# EAGLE design FlightControl (EAGLE 6.5.0)
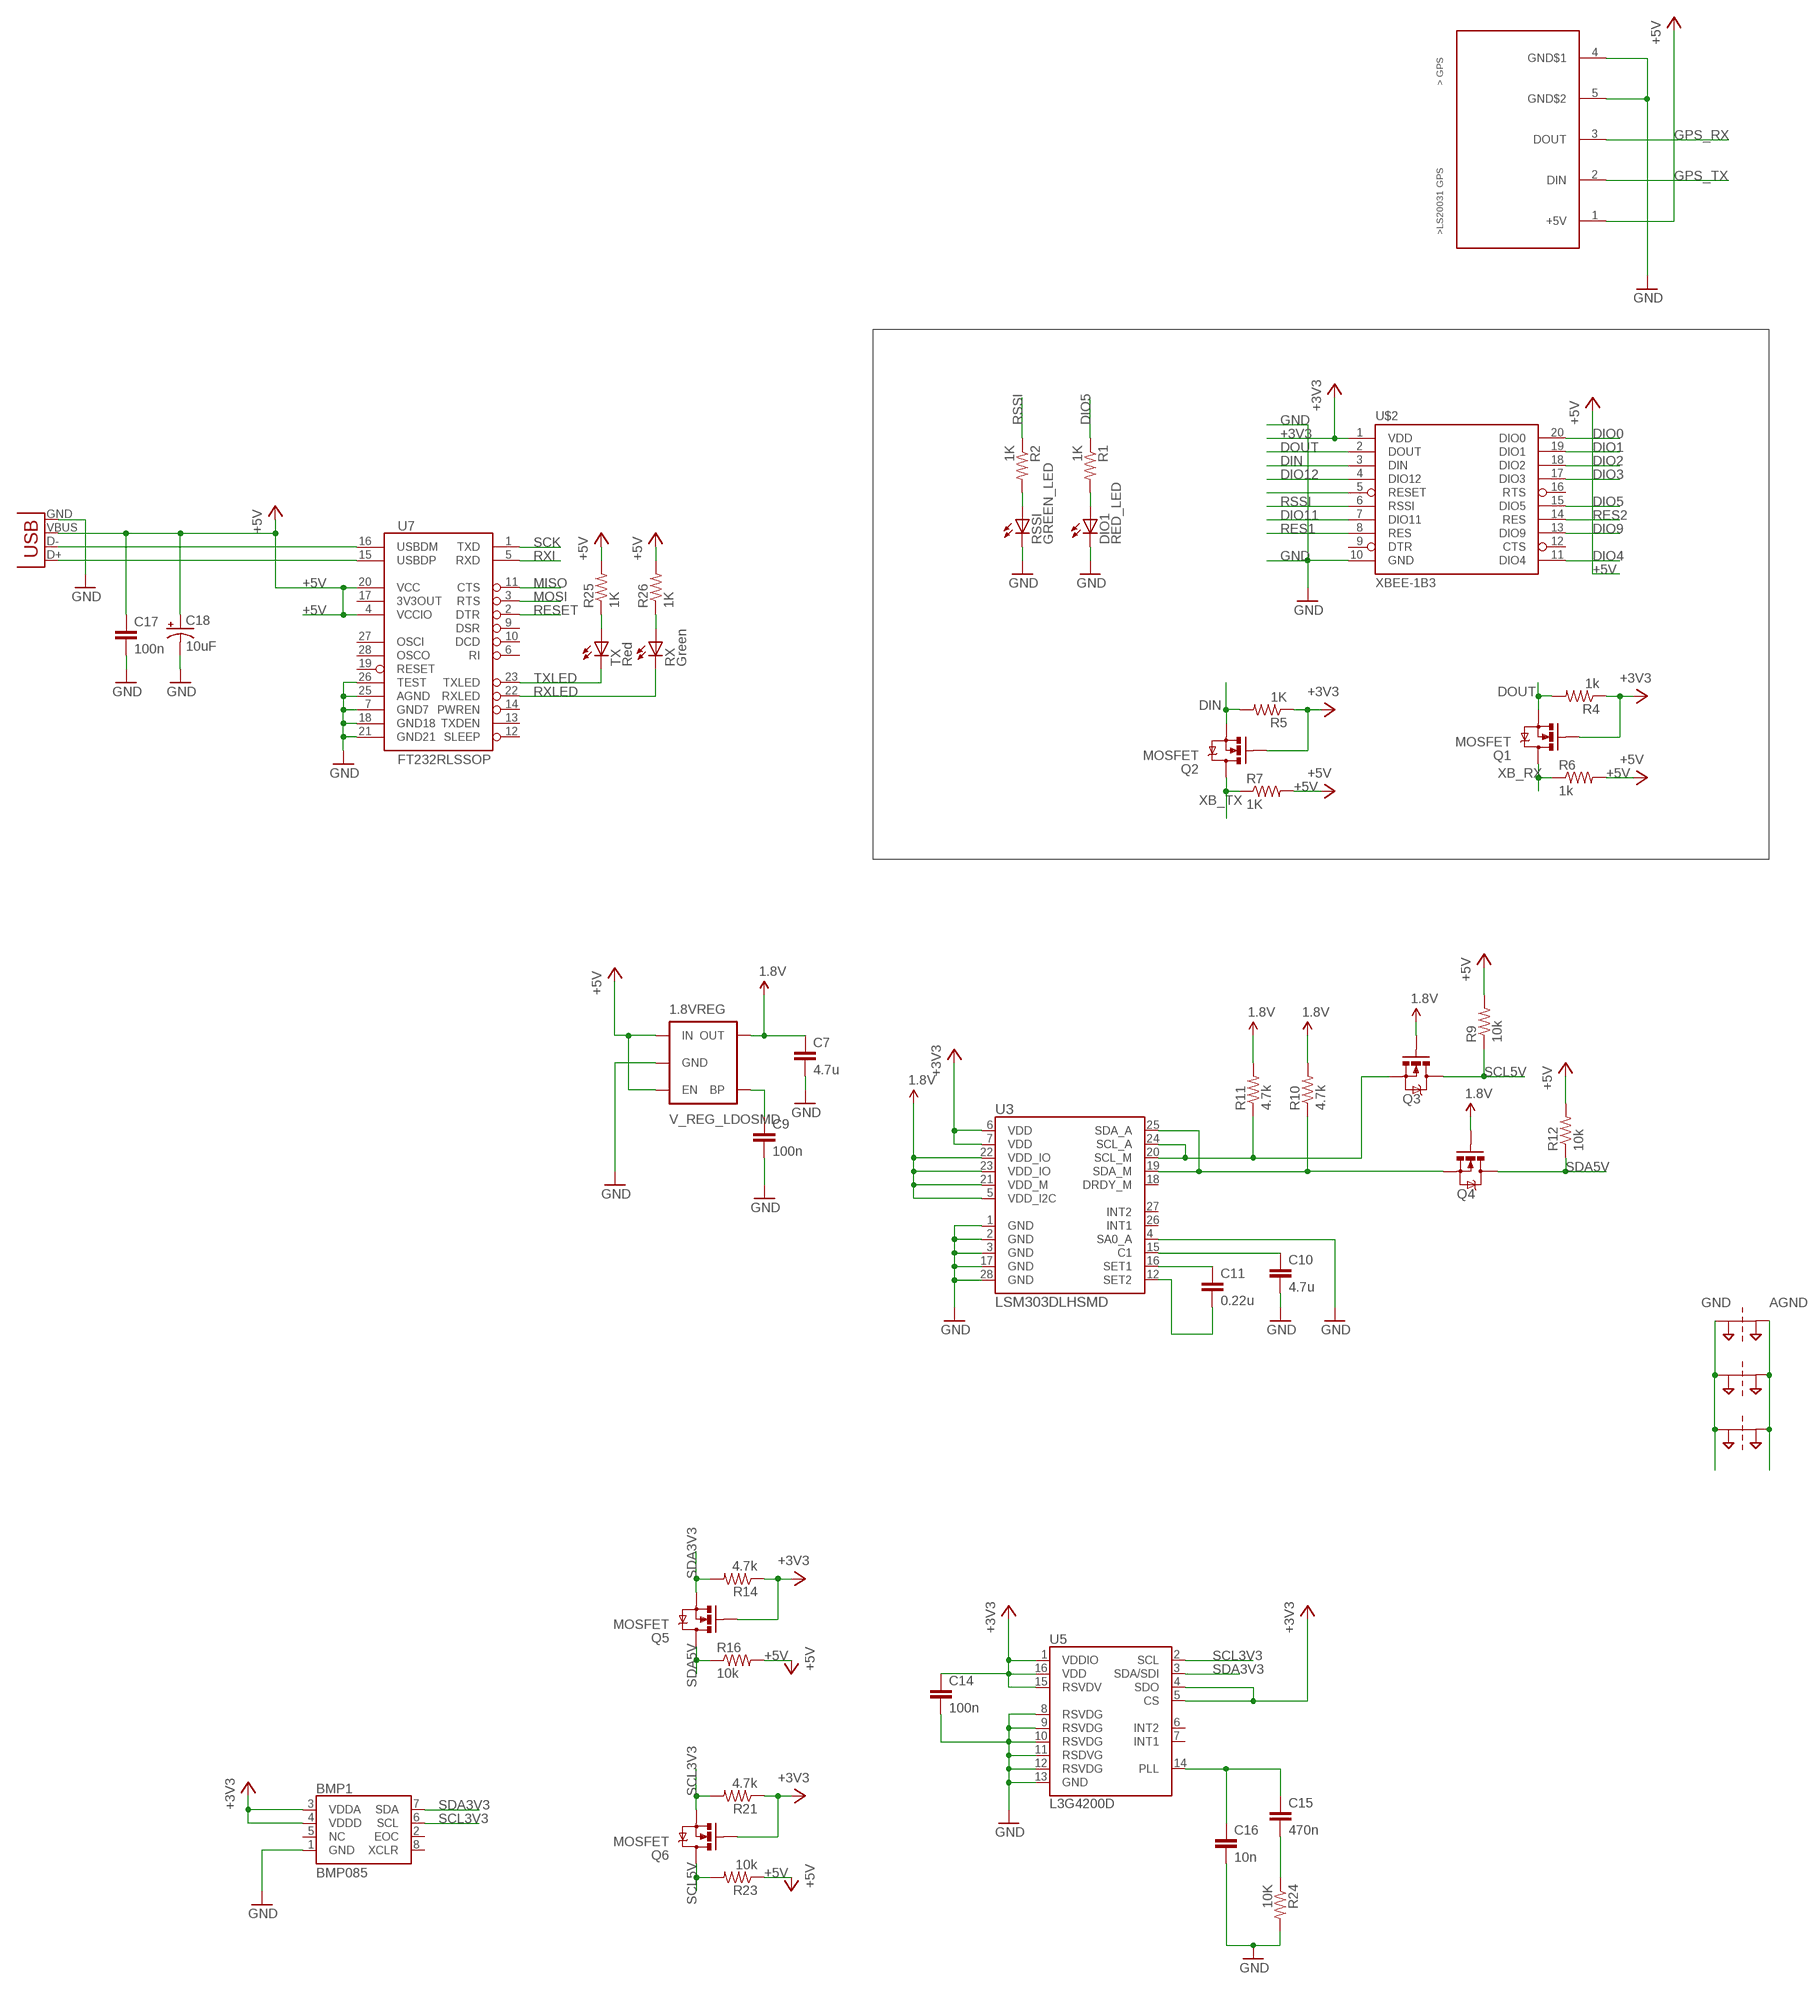
[diagram p0: schematic, sheet 1, part 1 of 2]
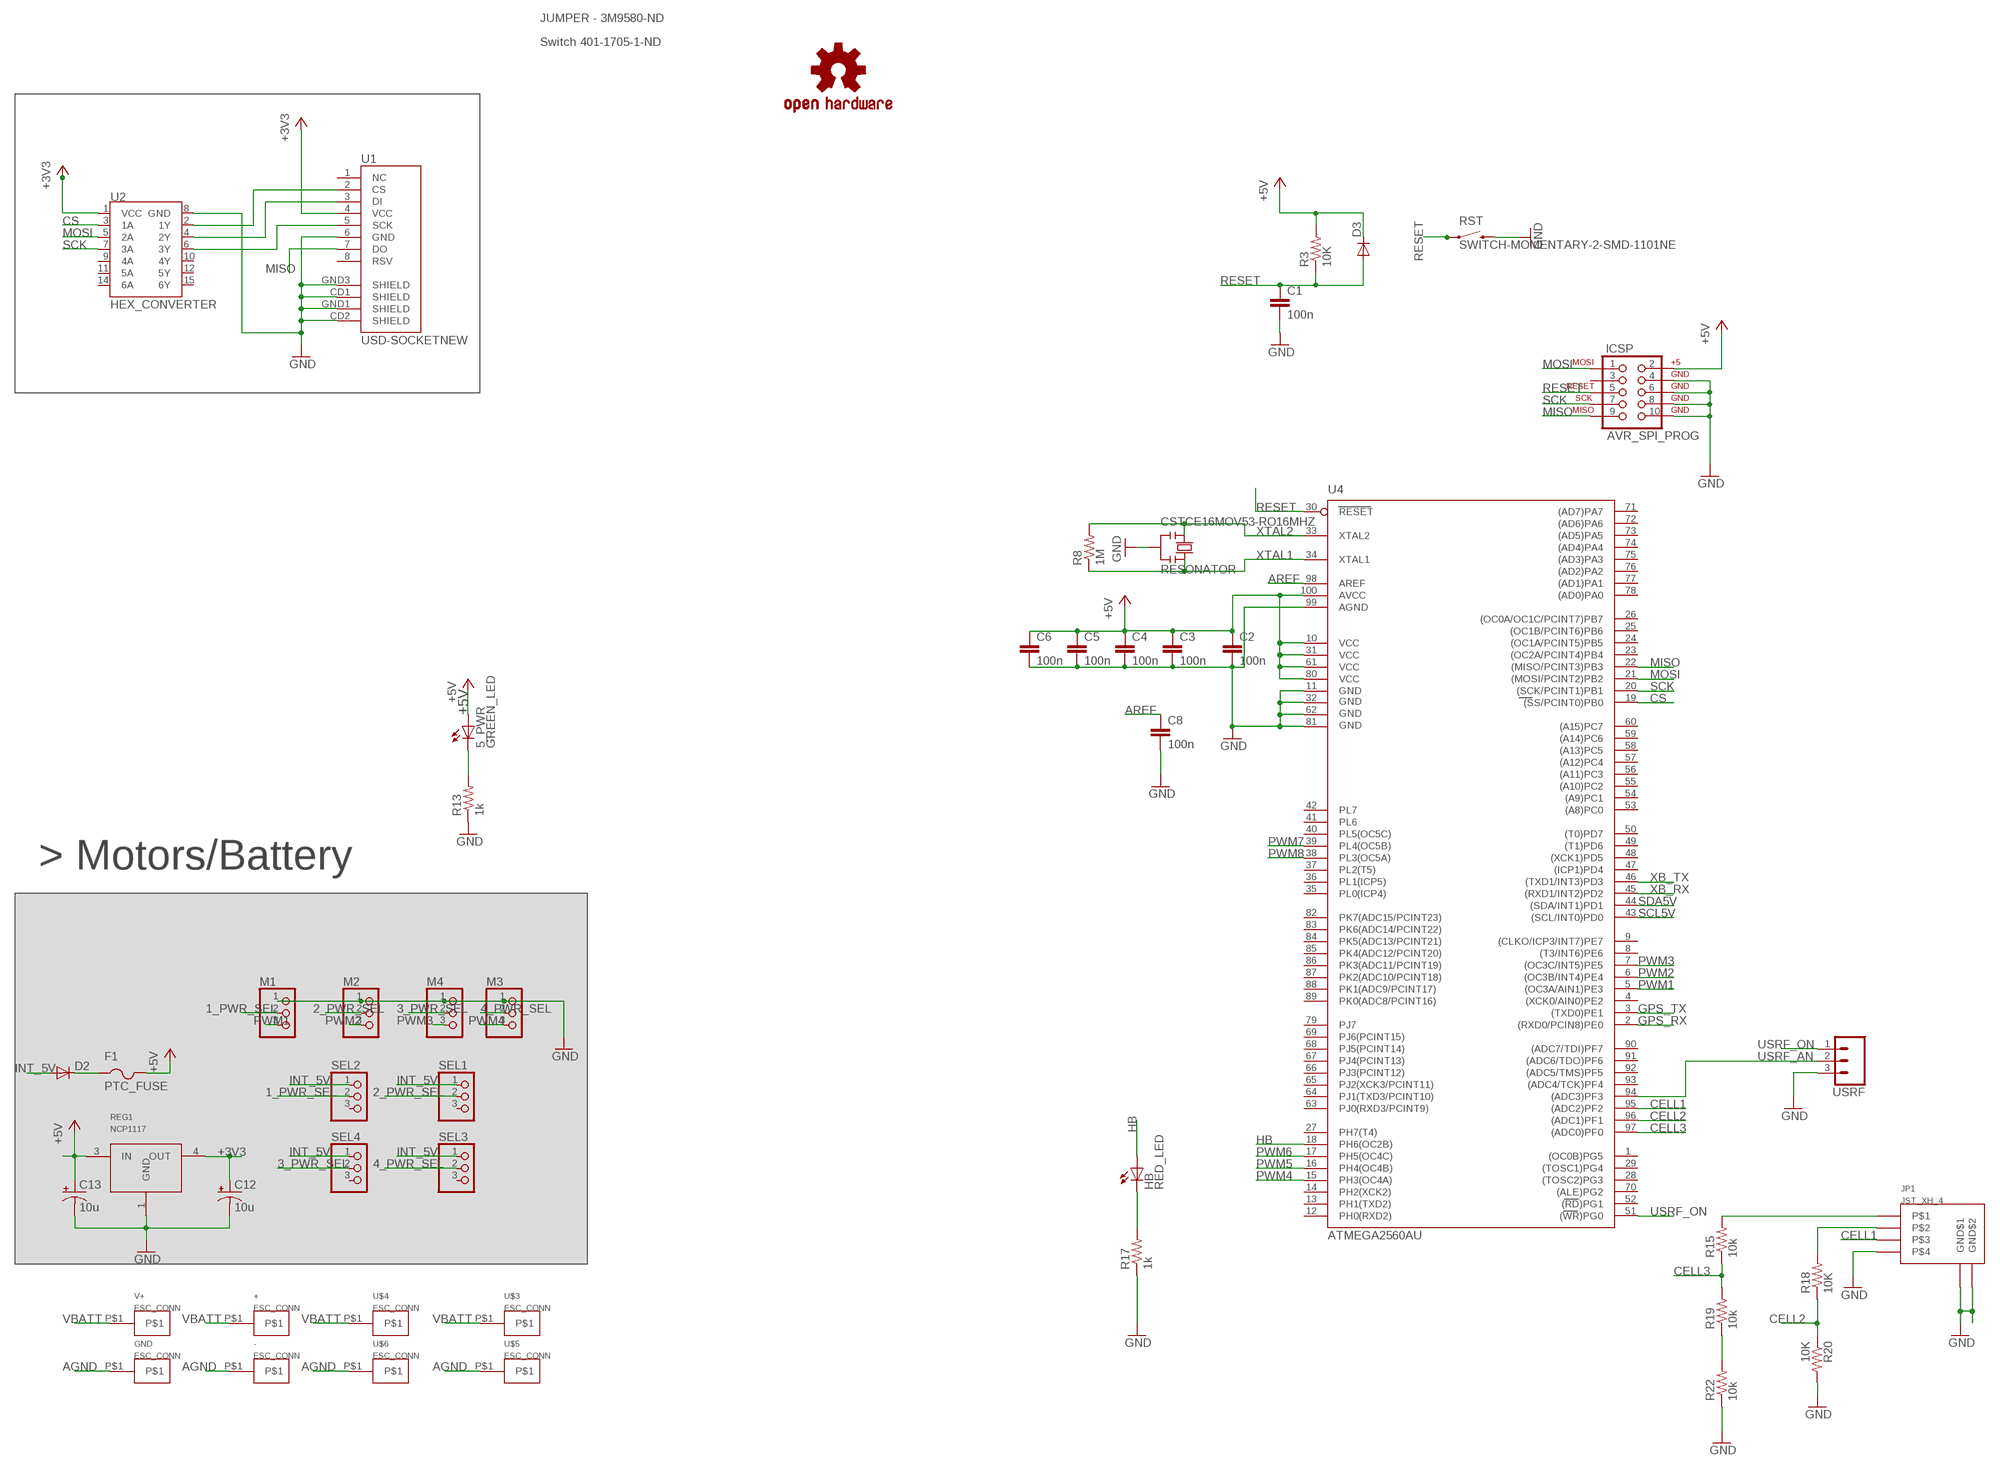
[diagram p1: schematic, sheet 1, part 2 of 2]

## Parts
1.8VREG  V_REG_LDOSMD  [SOT23-5]
5_PWR  GREEN_LED  LED0603  [LED-0603]
+  ESC_CONN  [ESC_CONN]
-  ESC_CONN  [ESC_CONN]
BMP1  BMP085  [BMP085]
C1  100n  CAP0402-CAP  [0402-CAP]
C2  100n  CAP0402-CAP  [0402-CAP]
C3  100n  CAP0402-CAP  [0402-CAP]
C4  100n  CAP0402-CAP  [0402-CAP]
C5  100n  CAP0402-CAP  [0402-CAP]
C6  100n  CAP0402-CAP  [0402-CAP]
C7  4.7u  CAP0402-CAP  [0402-CAP]
C8  100n  CAP0402-CAP  [0402-CAP]
C9  100n  CAP0402-CAP  [0402-CAP]
C10  4.7u  CAP0402-CAP  [0402-CAP]
C11  0.22u  CAP0402-CAP  [0402-CAP]
C12  10u  CAP_POL1206  [EIA3216]
C13  10u  CAP_POL1206  [EIA3216]
C14  100n  CAP0402-CAP  [0402-CAP]
C15  470n  CAP0402-CAP  [0402-CAP]
C16  10n  CAP0402-CAP  [0402-CAP]
C17  100n  CAP0402-CAP  [0402-CAP]
C18  10uF  CAP_POL1206  [EIA3216]
CSTCE16MOV53-RO16MHZ  RESONATOR  RESONATORMU  [RESONATOR]
D2  SCHOTTKY-1206D1206  [C1206]
D3  SCHOTTKY-1206D1206  [C1206]
DIO1  RED_LED  LED0603  [LED-0603]
F1  PTC_FUSE  PTCFUSE-1812  [1812]
GND  ESC_CONN  [ESC_CONN]
HB  RED_LED  LED0603  [LED-0603]
ICSP  AVR_SPI_PROG  [AVR_ICSP]
JP1  JST_XH_4  [JST-XH4]
LOGO1  OSHW-LOGOL  [OSHW-LOGO-L]
M1  PINHD-1X3  [1X03]
M2  PINHD-1X3  [1X03]
M3  PINHD-1X3  [1X03]
M4  PINHD-1X3  [1X03]
PT1  2PT_GND_TIE  [2PT_GND_TIE]
PT2  2PT_GND_TIE  [2PT_GND_TIE]
PT3  2PT_GND_TIE  [2PT_GND_TIE]
Q1  MOSFET  MOSFET-NCHANNELBSS138  [SOT23]
Q2  MOSFET  MOSFET-NCHANNELBSS138  [SOT23]
Q3  MOSFET  MOSFET-NCHANNELBSS138  [SOT23]
Q4  MOSFET  MOSFET-NCHANNELBSS138  [SOT23]
Q5  MOSFET  MOSFET-NCHANNELBSS138  [SOT23]
Q6  MOSFET  MOSFET-NCHANNELBSS138  [SOT23]
R1  1K  RESISTOR0603-RES  [0603-RES]
R2  1K  RESISTOR0603-RES  [0603-RES]
R3  10K  RESISTOR0603-RES  [0603-RES]
R4  1k  RESISTOR0603-RES  [0603-RES]
R5  1K  RESISTOR0603-RES  [0603-RES]
R6  1k  RESISTOR0603-RES  [0603-RES]
R7  1K  RESISTOR0603-RES  [0603-RES]
R8  1M  RESISTOR0603-RES  [0603-RES]
R9  10k  RESISTOR0603-RES  [0603-RES]
R10  4.7k  RESISTOR0402-RES  [0402-RES]
R11  4.7k  RESISTOR0603-RES  [0603-RES]
R12  10k  RESISTOR0603-RES  [0603-RES]
R13  1k  RESISTOR0603-RES  [0603-RES]
R14  4.7k  RESISTOR0603-RES  [0603-RES]
R15  10k  RESISTOR0603-RES  [0603-RES]
R16  10k  RESISTOR0603-RES  [0603-RES]
R17  1k  RESISTOR0603-RES  [0603-RES]
R18  10K  RESISTOR0603-RES  [0603-RES]
R19  10k  RESISTOR0603-RES  [0603-RES]
R20  10K  RESISTOR0603-RES  [0603-RES]
R21  4.7k  RESISTOR0603-RES  [0603-RES]
R22  10k  RESISTOR0603-RES  [0603-RES]
R23  10k  RESISTOR0603-RES  [0603-RES]
R24  10K  RESISTOR0603-RES  [0603-RES]
R25  1K  RESISTOR0603-RES  [0603-RES]
R26  1K  RESISTOR0603-RES  [0603-RES]
REG1  NCP1117  [DPAK]
RSSI  GREEN_LED  LED0603  [LED-0603]
RST  SWITCH-MOMENTARY-2-SMD-1101NE  [TACTILE-SWITCH-1101NE]
RX  Green  LED0603  [LED-0603]
SEL1  PINHD-1X3  [1X03]
SEL2  PINHD-1X3  [1X03]
SEL3  PINHD-1X3  [1X03]
SEL4  PINHD-1X3  [1X03]
TX  Red  LED0603  [LED-0603]
U1  USD-SOCKETNEW  [MICRO-SD-SOCKET-PP]
U2  HEX_CONVERTER  [SO016]
U3  LSM303DLHSMD  [LGA28-5X5]
U4  ATMEGA2560AU  [TQFP100]
U5  L3G4200D  [LGA16-4X4]
U7  FT232RLSSOP  [SSOP28DB]
U$1  LS20031  [LS20031]
U$2  XBEE-1B3  [XBEE-SMD]
U$3  ESC_CONN  [ESC_CONN]
U$4  ESC_CONN  [ESC_CONN]
U$5  ESC_CONN  [ESC_CONN]
U$6  ESC_CONN  [ESC_CONN]
USRF  M03LOCK  [1X03_LOCK]
V+  ESC_CONN  [ESC_CONN]
X2  USB-SMD-NS  [USB-MINIB-NOSTOP]

## Nets
1.8V: 1.8VREG.5(OUT) C7.1 Q3.1(G) Q4.1(G) R10.2 R11.2 U3.5(VDD_I2C) U3.21(VDD_M) U3.22(VDD_IO) U3.23(VDD_IO)
1_PWR_SEL: M1.2 SEL2.2
2_PWR_SEL: M2.2 SEL1.2
3_PWR_SEL: M4.2 SEL4.2
4_PWR_SEL: M3.2 SEL3.2
+3V3: BMP1.3(VDDA) BMP1.4(VDDD) C12.A(+) C14.1 Q1.1(G) Q2.1(G) Q5.1(G) Q6.1(G) R4.1 R5.1 R14.1 R21.1 REG1.4(OUT) U1.4(VCC) U2.1(VCC) U3.6(VDD) U3.7(VDD) U5.1(VDDIO) U5.4(SDO) U5.5(CS) U5.15(RSVDV) U5.16(VDD) U$2.1(VDD)
+5V: 1.8VREG.1(IN) 1.8VREG.3(EN) 5_PWR.A C2.1 C3.1 C4.1 C5.1 C6.1 C13.A(+) C17.1 C18.A(+) D3.2(C) F1.2 ICSP.2 R3.2 R6.2 R7.2 R9.2 R12.2 R16.2 R23.1 R25.2 R26.2 REG1.3(IN) U4.10(VCC) U4.31(VCC1) U4.61(VCC2) U4.80(VCC3) U4.100(AVCC) U7.4(VCCIO) U7.20(VCC) U$1.1(+5V) X2.VBUS
AGND: -.P$1 GND.P$1 PT1.P$2 PT2.P$2 PT3.P$2 U$5.P$1 U$6.P$1
AREF: C8.1 U4.98(AREF)
CELL1: JP1.P$3 U4.95((ADC2)PF2)
CELL2: R18.1 R20.1 U4.96((ADC1)PF1)
CELL3: R15.1 R19.2 U4.97((ADC0)PF0)
CS: U2.3(1A) U4.19((SS/PCINT0)PB0)
DIN: Q2.2(S) R5.2 U$2.3(DIN)
DIO0: U$2.20(DIO0)
DIO1: U$2.19(DIO1)
DIO2: U$2.18(DIO2)
DIO3: U$2.17(DIO3)
DIO4: U$2.11(DIO4)
DIO5: R1.1 U$2.15(DIO5)
DIO9: U$2.13(DIO9)
DIO11: U$2.7(DIO11)
DIO12: U$2.4(DIO12)
DOUT: Q1.2(S) R4.2 U$2.2(DOUT)
GND: 1.8VREG.2(GND) BMP1.1(GND) C1.2 C2.2 C3.2 C4.2 C5.2 C6.2 C7.2 C8.2 C9.2 C10.2 C12.C(-) C13.C(-) C14.2 C16.2 C17.2 C18.C(-) CSTCE16MOV53-RO16MHZ.2 DIO1.C ICSP.4 ICSP.6 ICSP.8 ICSP.10 JP1.GND$1 JP1.GND$2 JP1.P$4 M1.1 M2.1 M3.1 M4.1 PT1.P$1 PT2.P$1 PT3.P$1 R13.1 R17.1 R20.2 R22.1 R24.2 REG1.1(GND) RSSI.C RST.P$2 U1.6(GND) U1.CD1(SHIELD) U1.CD2(SHIELD) U1.GND1(SHIELD) U1.GND3(SHIELD) U2.8(GND) U3.1(GND) U3.2(GND) U3.3(GND) U3.4(SA0_A) U3.17(GND) U3.28(GND) U4.11(GND) U4.32(GND1) U4.62(GND2) U4.81(GND3) U4.99(AGND) U5.8(RSVDG) U5.9(RSVDG) U5.10(RSVDG) U5.11(RSDVG) U5.12(RSVDG) U5.13(GND) U7.7(GND7) U7.18(GND18) U7.21(GND21) U7.25(AGND) U7.26(TEST) U$1.4(GND$1) U$1.5(GND$2) U$2.10(GND) USRF.3 X2.GND
GPS_RX: U4.2((RXD0/PCIN8)PE0) U$1.3(DOUT)
GPS_TX: U4.3((TXD0)PE1) U$1.2(DIN)
HB: HB.A U4.18(PH6(OC2B))
INT_5V: D2.1(A) SEL1.1 SEL2.1 SEL3.1 SEL4.1
MISO: ICSP.9 U1.7(DO) U4.22((MISO/PCINT3)PB3) U7.11(CTS)
MOSI: ICSP.1 U2.5(2A) U4.21((MOSI/PCINT2)PB2) U7.3(RTS)
N$1: R19.1 R22.2
N$2: 1.8VREG.4(BP) C9.1
N$3: U1.2(CS) U2.2(1Y)
N$4: U1.3(DI) U2.4(2Y)
N$5: U1.5(SCK) U2.6(3Y)
N$6: C11.1 U3.16(SET1)
N$7: 5_PWR.C R13.2
N$8: DIO1.A R1.2
N$9: R2.2 RSSI.A
N$10: HB.C R17.2
N$11: R25.1 TX.A
N$12: U$2.5(RESET)
N$13: C11.2 U3.12(SET2)
N$14: C10.1 U3.15(C1)
N$15: D2.2(C) F1.1
N$16: Q3.2(S) R11.1 U3.20(SCL_M) U3.24(SCL_A)
N$17: Q4.2(S) R10.1 U3.19(SDA_M) U3.25(SDA_A)
N$18: JP1.P$2 R18.2
N$19: C15.1 C16.1 U5.14(PLL)
N$20: C15.2 R24.1
N$21: JP1.P$1 R15.2
N$22: R26.1 RX.A
PWM1: M1.3 U4.5((OC3A/AIN1)PE3)
PWM2: M2.3 U4.6((OC3B/INT4)PE4)
PWM3: M4.3 U4.7((OC3C/INT5)PE5)
PWM4: M3.3 U4.15(PH3(OC4A))
PWM5: U4.16(PH4(OC4B))
PWM6: U4.17(PH5(OC4C))
PWM7: U4.39(PL4(OC5B))
PWM8: U4.38(PL3(OC5A))
RES1: U$2.8(RES)
RES2: U$2.14(RES)
RESET: C1.1 D3.1(A) ICSP.5 R3.1 RST.P$1 U4.30(RESET) U7.2(DTR)
RSSI: R2.1 U$2.6(RSSI)
RXI: U7.5(RXD)
RXLED: RX.C U7.22(RXLED)
SCK: ICSP.7 U2.7(3A) U4.20((SCK/PCINT1)PB1) U7.1(TXD)
SCL3V3: BMP1.6(SCL) Q6.2(S) R21.2 U5.2(SCL)
SCL5V: Q3.3(D) Q6.3(D) R9.1 R23.2 U4.43((SCL/INT0)PD0)
SDA3V3: BMP1.7(SDA) Q5.2(S) R14.2 U5.3(SDA/SDI)
SDA5V: Q4.3(D) Q5.3(D) R12.1 R16.1 U4.44((SDA/INT1)PD1)
TXLED: TX.C U7.23(TXLED)
USB_D+: U7.15(USBDP) X2.D+
USB_D-: U7.16(USBDM) X2.D-
USRF_AN: U4.94((ADC3)PF3) USRF.2
USRF_ON: U4.51((WR)PG0) USRF.1
VBATT: +.P$1 U$3.P$1 U$4.P$1 V+.P$1
XB_RX: Q1.3(D) R6.1 U4.45((RXD1/INT2)PD2)
XB_TX: Q2.3(D) R7.1 U4.46((TXD1/INT3)PD3)
XTAL1: CSTCE16MOV53-RO16MHZ.3 R8.1 U4.34(XTAL1)
XTAL2: CSTCE16MOV53-RO16MHZ.1 R8.2 U4.33(XTAL2)
Unconnected: BMP1.2(EOC) BMP1.5(NC) BMP1.8(XCLR) ICSP.3 SEL1.3 SEL2.3 SEL3.3 SEL4.3 U1.1(NC) U1.8(RSV) U2.9(4A) U2.10(4Y) U2.11(5A) U2.12(5Y) U2.14(6A) U2.15(6Y) U3.18(DRDY_M) U3.26(INT1) U3.27(INT2) U4.1((OC0B)PG5) U4.4((XCK0/AIN0)PE2) U4.8((T3/INT6)PE6) U4.9((CLKO/ICP3/INT7)PE7) U4.12(PH0(RXD2)) U4.13(PH1(TXD2)) U4.14(PH2(XCK2)) U4.23((OC2A/PCINT4)PB4) U4.24((OC1A/PCINT5)PB5) U4.25((OC1B/PCINT6)PB6) U4.26((OC0A/OC1C/PCINT7)PB7) U4.27(PH7(T4)) U4.28((TOSC2)PG3) U4.29((TOSC1)PG4) U4.35(PL0(ICP4)) U4.36(PL1(ICP5)) U4.37(PL2(T5)) U4.40(PL5(OC5C)) U4.41(PL6) U4.42(PL7) U4.47((ICP1)PD4) U4.48((XCK1)PD5) U4.49((T1)PD6) U4.50((T0)PD7) U4.52((RD)PG1) U4.53((A8)PC0) U4.54((A9)PC1) U4.55((A10)PC2) U4.56((A11)PC3) U4.57((A12)PC4) U4.58((A13)PC5) U4.59((A14)PC6) U4.60((A15)PC7) U4.63(PJ0(RXD3/PCINT9)) U4.64(PJ1(TXD3/PCINT10)) U4.65(PJ2(XCK3/PCINT11)) U4.66(PJ3(PCINT12)) U4.67(PJ4(PCINT13)) U4.68(PJ5(PCINT14)) U4.69(PJ6(PCINT15)) U4.70((ALE)PG2) U4.71((AD7)PA7) U4.72((AD6)PA6) U4.73((AD5)PA5) U4.74((AD4)PA4) U4.75((AD3)PA3) U4.76((AD2)PA2) U4.77((AD1)PA1) U4.78((AD0)PA0) U4.79(PJ7) U4.82(PK7(ADC15/PCINT23)) U4.83(PK6(ADC14/PCINT22)) U4.84(PK5(ADC13/PCINT21)) U4.85(PK4(ADC12/PCINT20)) U4.86(PK3(ADC11/PCINT19)) U4.87(PK2(ADC10/PCINT18)) U4.88(PK1(ADC9/PCINT17)) U4.89(PK0(ADC8/PCINT16)) U4.90((ADC7/TDI)PF7) U4.91((ADC6/TDO)PF6) U4.92((ADC5/TMS)PF5) U4.93((ADC4/TCK)PF4) U5.6(INT2) U5.7(INT1) U7.6(RI) U7.9(DSR) U7.10(DCD) U7.12(SLEEP) U7.13(TXDEN) U7.14(PWREN) U7.17(3V3OUT) U7.19(RESET) U7.27(OSCI) U7.28(OSCO) U$2.9(DTR) U$2.12(CTS) U$2.16(RTS)

## Notes on the sheet
- JUMPER - 3M9580-ND
- Switch 401-1705-1-ND
- > Motors/Battery

## Library data of the parts
1.8VREG = SparkFun-PowerIC:V_REG_LDO: Voltage Regulator LDO Standard 150mA LDO voltage regulator in SOT-23 layout. Micrel part MIC5205. BP (by-pass) pin is used to lower output noise with 470pF cap.
5_PWR DIO1 HB RSSI = SparkFun-LED:LED: LEDs Standard schematic elements and footprints for 5mm, 3mm, 1206, and 0603 sized LEDs. 5mm - Spark Fun Electronics SKU : COM-00529 (and others)
+ - GND U$3-U$6 V+ = OSQ_lib:ESC_CONN
BMP1 = SparkFun:BMP085: BMP085 Pressure Sensor Great little MEMS pressure sensor. SKU: COM-09603
C1-C11 C15 C16 = SparkFun-Passives:CAP: Capacitor Standard 0603 ceramic capacitor, and 0.1" leaded capacitor.
C12 C13 = SparkFun-Capacitors:CAP_POL: Capacitor Polarized These are standard SMD and PTH capacitors. Normally 10uF, 47uF, and 100uF in electrolytic and tantalum varieties. Always verify the external diameter of the through hole cap, it varies with capacity, voltage, and manufacturer. The EIA devices should be standard.
C14 = SparkFun-Capacitors:CAP: Capacitor Standard 0603 ceramic capacitor, and 0.1" leaded capacitor.
C17 = SparkFun:CAP: Capacitor Standard 0603 ceramic capacitor, and 0.1" leaded capacitor.
C18 = SparkFun:CAP_POL: Capacitor Polarized These are standard SMD and PTH capacitors. Normally 10uF, 47uF, and 100uF in electrolytic and tantalum varieties. Always verify the external diameter of the through hole cap, it varies with capacity, voltage, and manufacturer. The EIA devices should be standard.
CSTCE16MOV53-RO16MHZ = SmartPrj:RESONATOR
D2 D3 = adafruit:SCHOTTKY-1206
F1 = adafruit:PTCFUSE: PTC fuses, resettable thermistors
ICSP = SparkFun-Connectors:AVR_SPI_PROG: AVR 10-pin ICSP Header This is the standard AVR In Circuit Serial Programming header. Minimal, but includes pin one indicator. Works with standard Olimex programmers. Also look for the 6-pin reduced version. Spark Fun Electronics SKU: PRT-00778
JP1 = OSQ_lib:JST_XH_4
LOGO1 = SparkFun-Aesthetics:OSHW-LOGO: Open Source Hardware Logo This logo indicates the piece of hardware it is found on incorporates a OSHW license and/or adheres to the definition of open source hardware found here: http://freedomdefined.org/OSHW
M1-M4 SEL1-SEL4 = pinhead:PINHD-1X3: PIN HEADER
PT1-PT3 = SparkFun-Passives:2PT_GND_TIE: Package for connecting two ground nets in one place.
Q1-Q6 = SparkFun-DiscreteSemi:MOSFET-NCHANNEL: Common NMOSFET Parts MFG P/N Store ID Prod ID FDD8780 TRANS-09984 SI7820DN TRANS-11055 FDS6630A IC-08089 2N7002PW TRANS-11151 FQP30N06L COM-10213 TRANS-10060 BSS123LT1G TRANS-08345 BSS138 TRANS-00830 BS170 2N7000; PROD_ID: TRANS-00830
R1-R26 = SparkFun-Passives:RESISTOR: Resistor Basic schematic elements and footprints for 0603, 1206, and PTH resistors.
REG1 = v-reg:NCP1117
RST = SparkFun-Electromechanical:SWITCH-MOMENTARY-2: Various NO switches- pushbuttons, reed, etc
RX TX = SparkFun:LED: LEDs Standard schematic elements and footprints for 5mm, 3mm, 1206, and 0603 sized LEDs. 5mm - Spark Fun Electronics SKU : COM-00529 (and others)
U1 = SparkFun-Connectors:USD-SOCKET: microSD Socket Push-push type uSD socket. Schematic element and footprint production proven. Spark Fun Electronics SKU : PRT-00127. tDoc lines correctly indicate media card edge positions when inserting (unlocked, locked, depressed).
U2 = SparkFun-DigitalIC:HEX_CONVERTER: Just what it says.
U3 = SparkFun-Sensors:LSM303DLH: I2C accelerometer/magnetometer/tilt compensated compass
U4 = SparkFun-DigitalIC:ATMEGA2560: Atmel 100-pin 8-bit uC 64/128/256 Kbytes FLASH 4 Kbytes EEPROM 8 Kbytes SRAM 86 General Purpose I/O pins 12-channels16-bit PWM 4 x Serial USARTs 16-channels 10-bit A/D
U5 = SparkFun-Sensors:L3G4200D: L3G4200D Three-axis, digital output gyroscope The L3G4200D is a low-power three-axis angular rate sensor, has a full scale of ±250/±500/±2000 dps and is capable of measuring rates with a user-selectable bandwidth. It includes a sensing element and an IC interface capable of providing the measured angular rate to the external world through a digital interface (I2C/SPI). Package: 4x4x1.1 LGA-16 (LGA16-4x4.PAC)
U7 = SparkFun:FT232RL: USB UART FT232RL 4th Generation USB UART (USB <-> Serial) Controller. Spark Fun Electronics SKU : COM-00650
U$1 = MyLib:LS20031
U$2 = SparkFun-RF:XBEE-1: Xbee module footprints SMT header is CONN-09042.; PROD_ID: CONN-09042
USRF = SparkFun-Connectors:M03: Header 3 Standard 3-pin 0.1" header. Use with straight break away headers (SKU : PRT-00116), right angle break away headers (PRT-00553), swiss pins (PRT-00743), machine pins (PRT-00117), and female headers (PRT-00115). Molex polarized connector foot print use with SKU : PRT-08232 with associated crimp pins and housings.
X2 = SparkFun:USB: USB Connectors USB-B-PTH is fully proven SKU : PRT-00139 USB-miniB is fully proven SKU : PRT-00587 USB-A-PCB is untested. USB-A-H is throughly reviewed, but untested. Spark Fun Electronics SKU : PRT-00437 USB-B-SMT is throughly reviewed, but untested. Needs silkscreen touching up. USB-A-S has not been used/tested USB-MB-H has not been used/tested

## Net classes
0 default: clearance 0.205 mm
1 power: width 0.254 mm

## Board
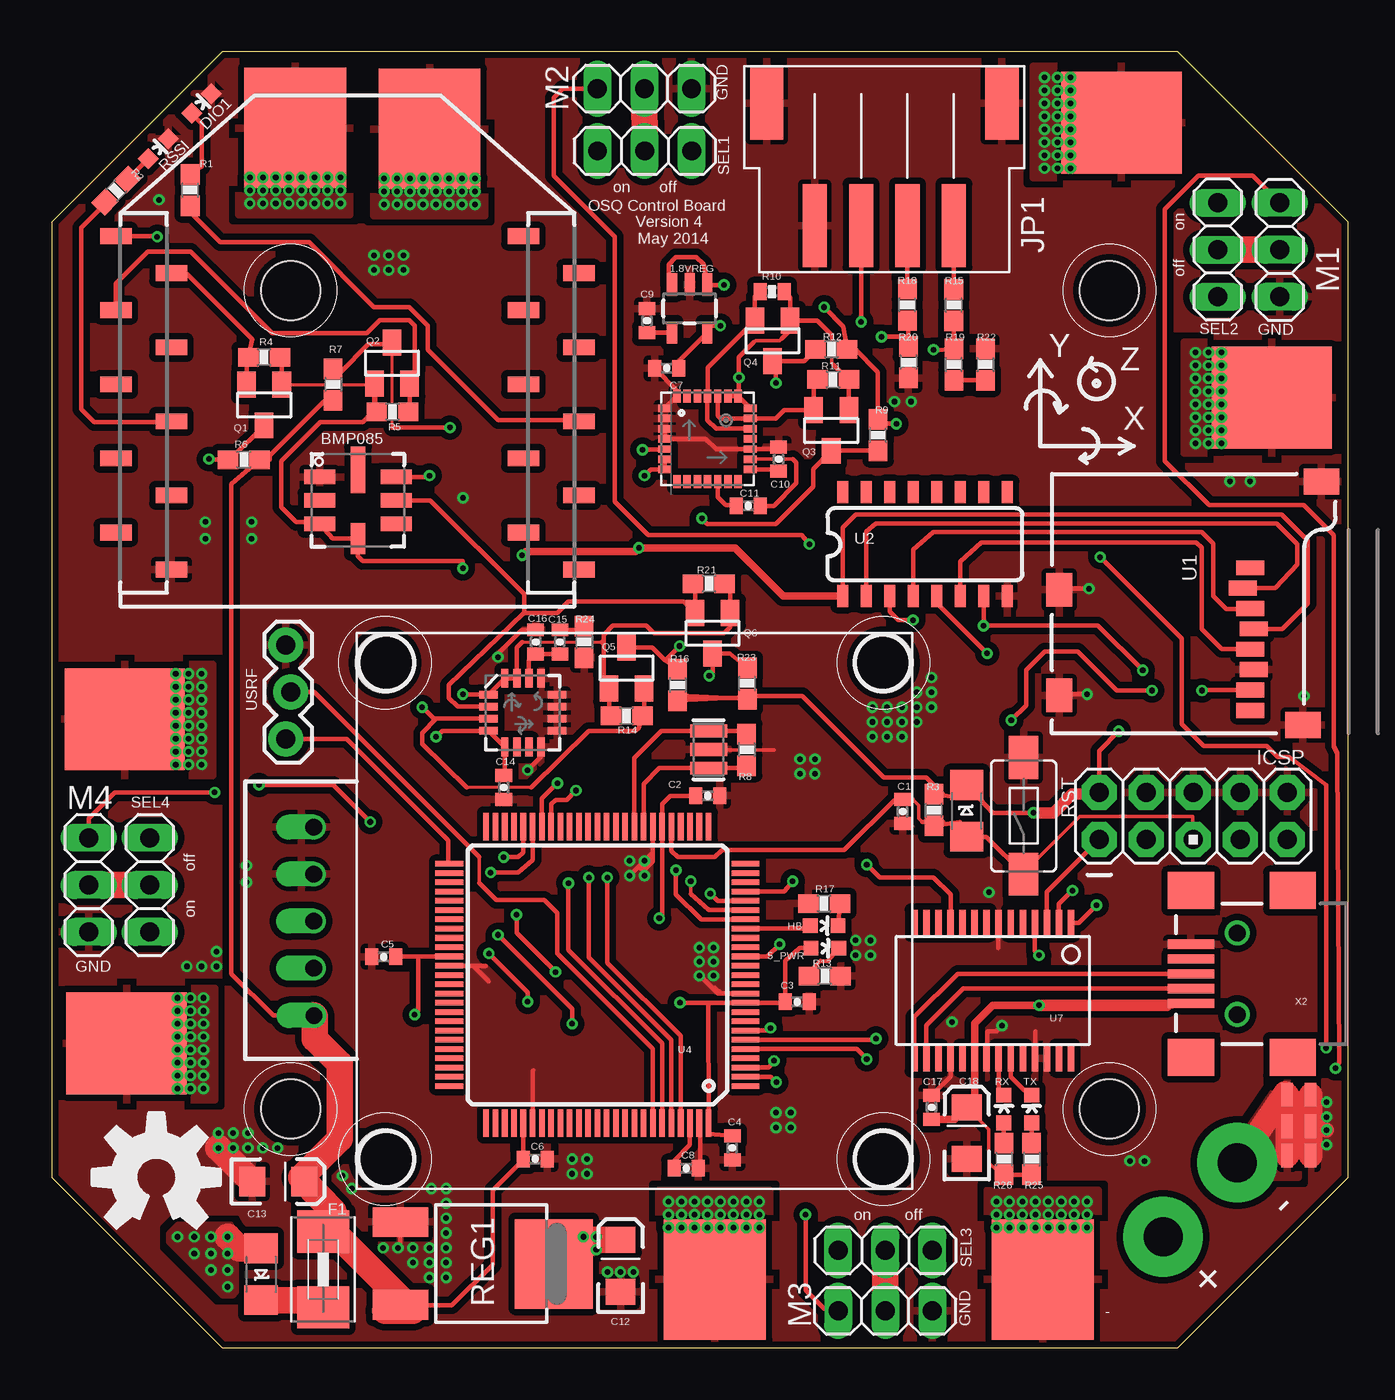
[diagram p2: board, top side]
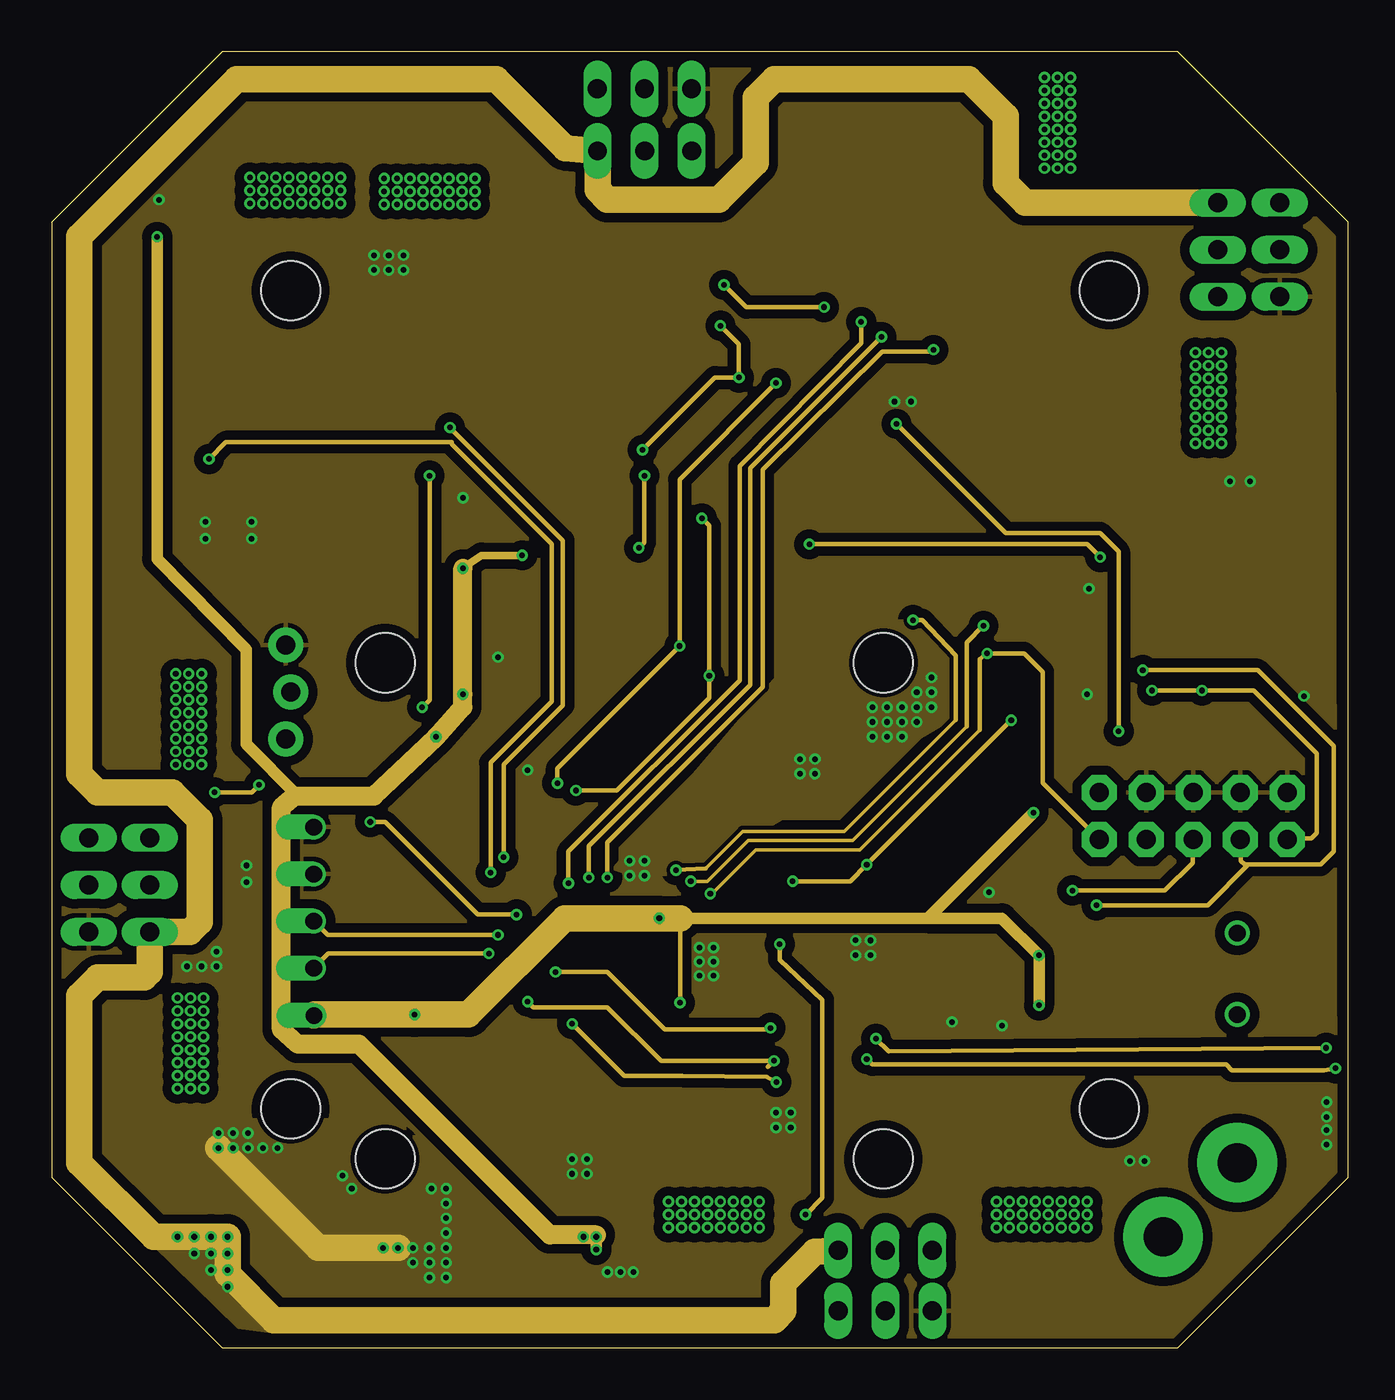
[diagram p3: board, inner layer Route2]
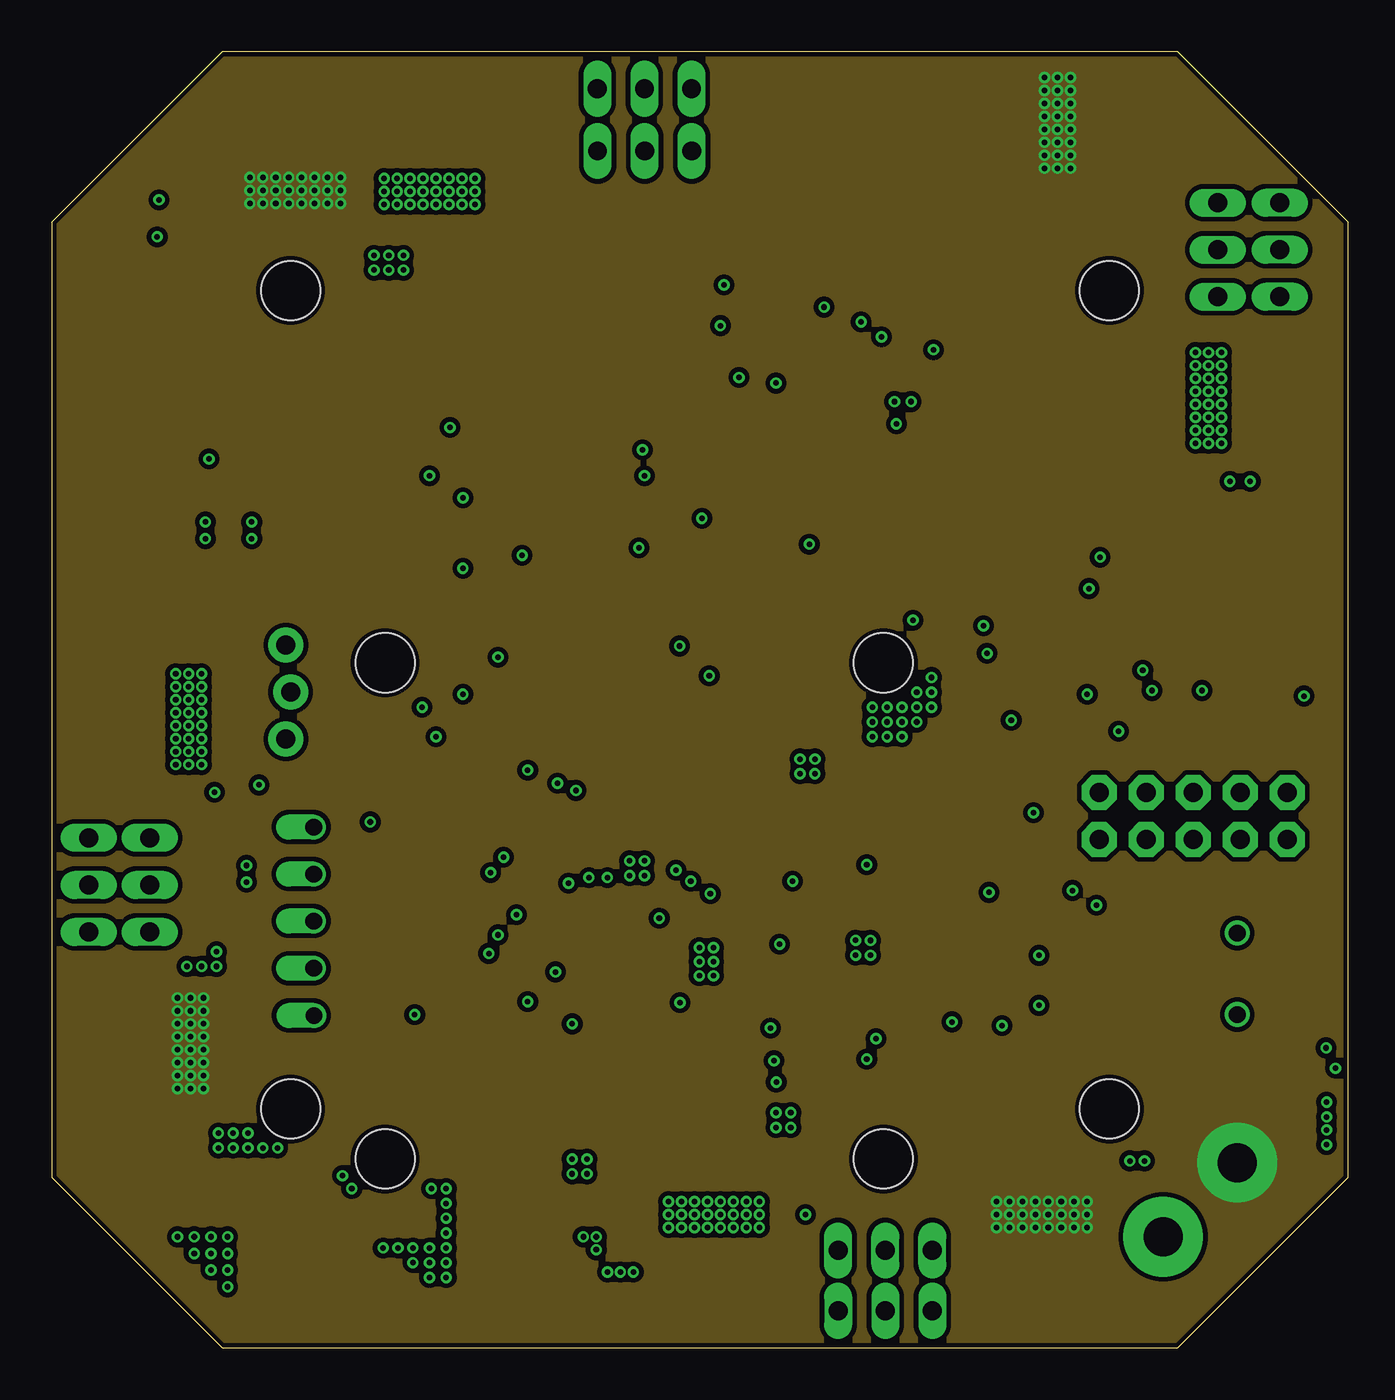
[diagram p4: board, inner layer Route15]
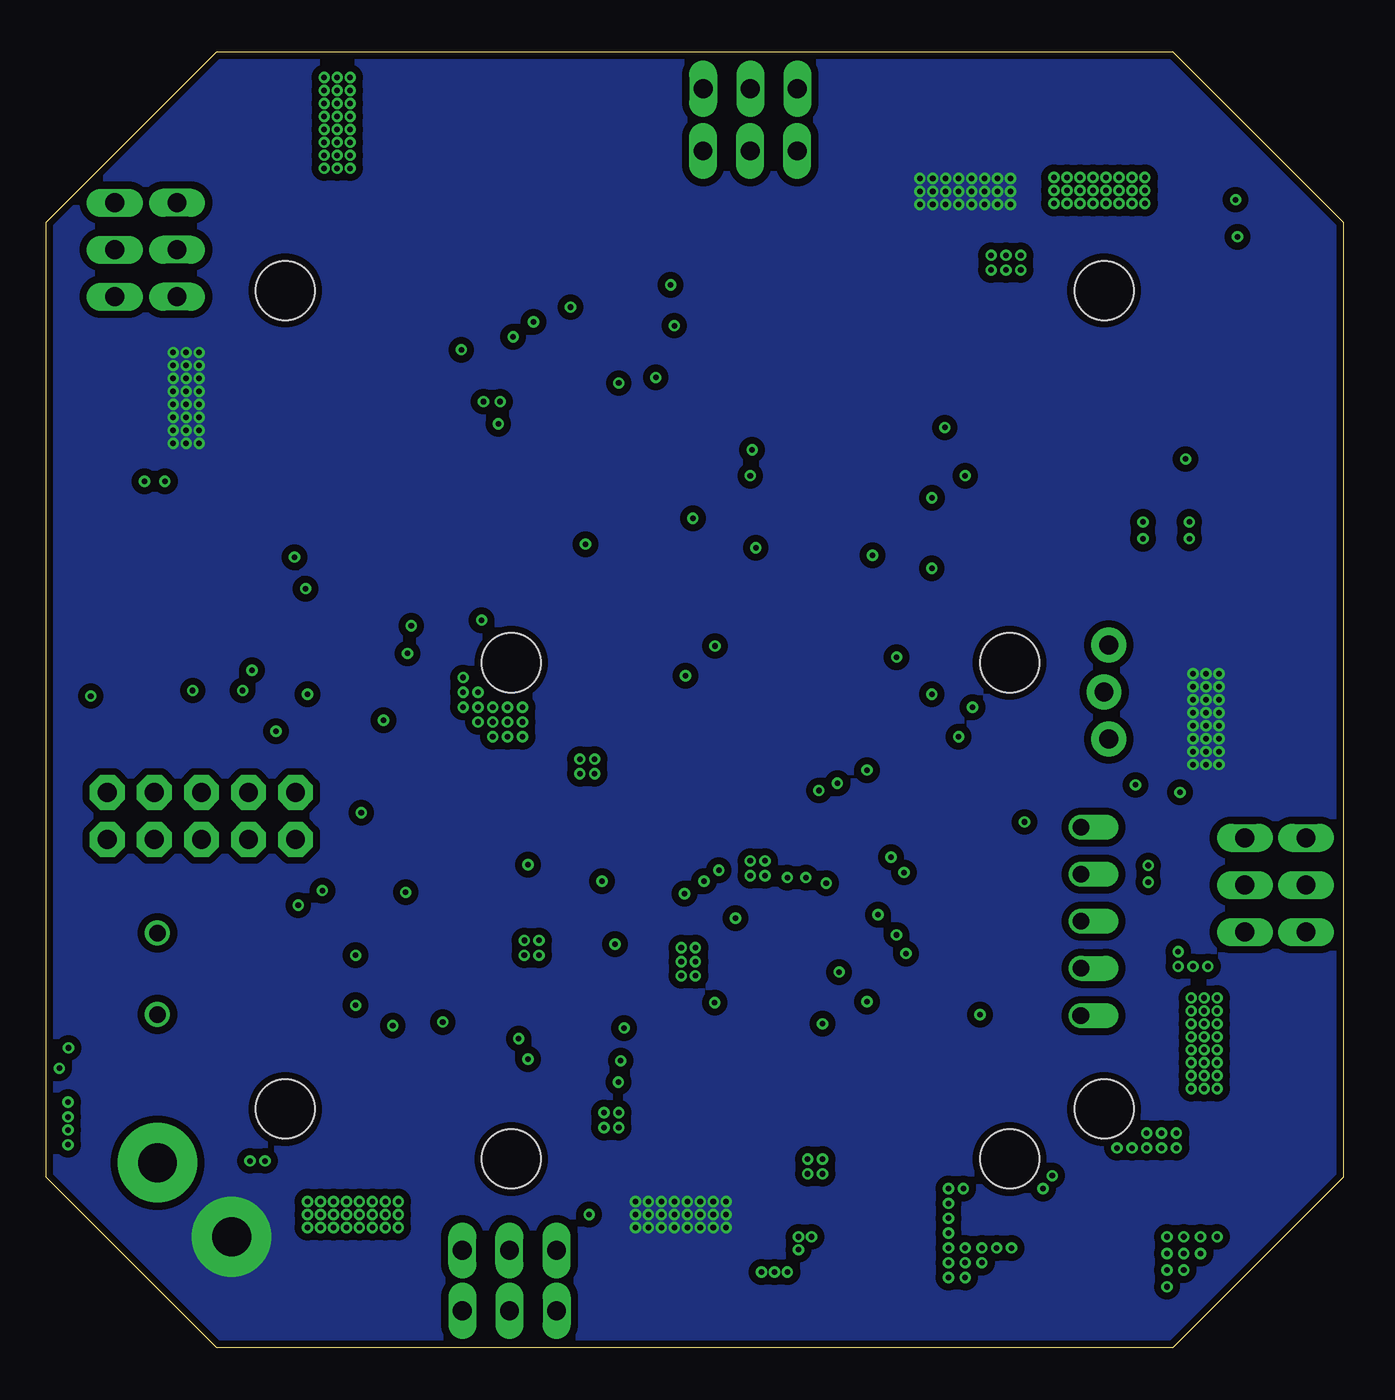
[diagram p5: board, bottom side, seen from below]

Size 70 x 70 mm. Coordinates in mm from the lower left corner, seen from the top.
Outline: 0,60.8 0,9.2 9.2,0 60.8,0 70,9.2 70,60.8 60.8,70 9.2,70 0,60.8
Copper layers (1*2+15*16): Top 0.035559375mm / dielectric 0.17018125mm / Route2 0.01778125mm / dielectric 47mil / Route15 0.01778125mm / dielectric 0.17018125mm / Bottom 0.035559375mm
Design rules "SeeedStudio_DRU_no_angle_20130527 *": minimum track width 5mil, minimum drill 10mil, track to track 5mil, track to pad 5mil, pad to pad 5mil, via to via 5mil, smd to smd 0mil, copper to edge 10mil, drill to drill 10mil, minimum pad ring 6mil, minimum via ring 6mil, stop-mask expansion 2mil, vias tented up to drill 25mil, thermal gap 10mil
Holes 3.2 mm at 18,10.2 44.9,37 18,37 12.9,12.9 57.1,12.9 57.1,57.1 12.9,57.1 44.9,10.2

### Footprints (pad centres in the part's own frame; a part is rotated, then mirrored left to right if it is on the bottom)
SOT23-5 = smd 0.55 x 1.2: 1 -0.95,-1.3; 2 0,-1.3; 3 0.95,-1.3; 4 0.95,1.3; 5 -0.95,1.3
LED-0603 = smd 0.8 x 0.8: A 0,-0.75; C 0,0.75
ESC_CONN = smd 5.5 x 6.5: P$1 0,0
BMP085 = smd 1.67 x 0.8: 1 -2.065,1.27; 2 -2.065,0; 3 -2.065,-1.27; 5 2.065,-1.27; 6 2.065,0; 7 2.065,1.27 | smd 0.8 x 1.67: 4 0,-2.065 | smd 0.8 x 2.5: 8 0,1.65
0402-CAP = smd 0.7 x 0.9: 1 -0.65,0; 2 0.65,0
EIA3216 = smd 1.4 x 1.6: A 1.4,0; C -1.4,0
RESONATOR = smd 0.7 x 2: 1 -1,0; 2 0,0; 3 1,0
C1206 = smd 1.6 x 1.8: 1 -1.4,0; 2 1.4,0
1812 = smd 2.286 x 2.794: 1 -2.046,0; 2 2.046,0
AVR_ICSP = drill 1.016 pad 1.88 octagon: 1 -1.27,5.08; 2 1.27,5.08; 3 -1.27,2.54; 4 1.27,2.54; 5 -1.27,0; 6 1.27,0; 7 -1.27,-2.54; 8 1.27,-2.54; 9 -1.27,-5.08; 10 1.27,-5.08
JST-XH4 = smd 1.8 x 3.9: GND$1 1.4,2; GND$2 14.1,2 | smd 1.3 x 4.5: P$1 4,8.6; P$2 6.5,8.6; P$3 9,8.6; P$4 11.5,8.6
1X03 = drill 1.016 long: 1 -2.54,0; 2 0,0; 3 2.54,0
2PT_GND_TIE = smd 1.27 x 0.635: P$1 0,0.635; P$2 0,-0.635
SOT23 = smd 1 x 1.4: 1 -0.95,-1.1; 2 0.95,-1.1; 3 0,1.1
0603-RES = smd 1.1 x 1: 1 -0.85,0; 2 0.85,0
0402-RES = smd 0.7 x 0.9: 1 -0.65,0; 2 0.65,0
DPAK = smd 1.6 x 2.997: 1 -2.261,-4.928; 3 2.21,-4.928 | smd 4.826 x 4.191: 4 0,3.353
TACTILE-SWITCH-1101NE = smd 2.3 x 1.6: P$1 -3.15,0; P$2 3.15,0
MICRO-SD-SOCKET-PP = smd 0.8 x 1.5: 1 -8.94,10.7; 2 -7.84,10.3; 3 -6.74,10.7; 4 -5.64,10.9; 5 -4.54,10.7; 6 -3.44,10.9; 7 -2.34,10.7; 8 -1.24,10.7 | smd 1.8 x 1.4: CD1 -2.05,0.4; CD2 -7.75,0.4 | smd 1.4 x 1.9: GND1 -13.6,14.55; GND3 -0.45,13.55
SO016 = smd 0.6 x 1.2: 1 -4.445,-2.8; 2 -3.175,-2.8; 3 -1.905,-2.8; 4 -0.635,-2.8; 5 0.635,-2.8; 6 1.905,-2.8; 7 3.175,-2.8; 8 4.445,-2.8; 9 4.445,2.8; 10 3.175,2.8; 11 1.905,2.8; 12 0.635,2.8; 13 -0.635,2.8; 14 -1.905,2.8; 15 -3.175,2.8; 16 -4.445,2.8
LGA28-5X5 = smd 0.7 x 0.4: 1 -2.3,1.65; 2 -2.3,1.1; 3 -2.3,0.55; 4 -2.3,0; 5 -2.3,-0.55; 6 -2.3,-1.1; 7 -2.3,-1.65; 15 2.3,-1.65; 16 2.3,-1.1; 17 2.3,-0.55; 18 2.3,0; 19 2.3,0.55; 20 2.3,1.1; 21 2.3,1.65 | smd 0.4 x 0.7: 8 -1.65,-2.3; 9 -1.1,-2.3; 10 -0.55,-2.3; 11 0,-2.3; 12 0.55,-2.3; 13 1.1,-2.3; 14 1.65,-2.3; 22 1.65,2.3; 23 1.1,2.3; 24 0.55,2.3; 25 0,2.3; 26 -0.55,2.3; 27 -1.1,2.3; 28 -1.65,2.3
TQFP100 = smd 1.5 x 0.3: 1 -8,6; 2 -8,5.5; 3 -8,5; 4 -8,4.5; 5 -8,4; 6 -8,3.5; 7 -8,3; 8 -8,2.5; 9 -8,2; 10 -8,1.5; 11 -8,1; 12 -8,0.5; 13 -8,0; 14 -8,-0.5; 15 -8,-1; 16 -8,-1.5; 17 -8,-2; 18 -8,-2.5; 19 -8,-3; 20 -8,-3.5; 21 -8,-4; 22 -8,-4.5; 23 -8,-5; 24 -8,-5.5; 25 -8,-6; 51 8,-6; 52 8,-5.5; 53 8,-5; 54 8,-4.5; 55 8,-4; 56 8,-3.5; 57 8,-3; 58 8,-2.5; 59 8,-2; 60 8,-1.5; 61 8,-1; 62 8,-0.5; 63 8,0; 64 8,0.5; 65 8,1; 66 8,1.5; 67 8,2; 68 8,2.5; 69 8,3; 70 8,3.5; 71 8,4; 72 8,4.5; 73 8,5; 74 8,5.5; 75 8,6 | smd 0.3 x 1.5: 26 -6,-8; 27 -5.5,-8; 28 -5,-8; 29 -4.5,-8; 30 -4,-8; 31 -3.5,-8; 32 -3,-8; 33 -2.5,-8; 34 -2,-8; 35 -1.5,-8; 36 -1,-8; 37 -0.5,-8; 38 0,-8; 39 0.5,-8; 40 1,-8; 41 1.5,-8; 42 2,-8; 43 2.5,-8; 44 3,-8; 45 3.5,-8; 46 4,-8; 47 4.5,-8; 48 5,-8; 49 5.5,-8; 50 6,-8; 76 6,8; 77 5.5,8; 78 5,8; 79 4.5,8; 80 4,8; 81 3.5,8; 82 3,8; 83 2.5,8; 84 2,8; 85 1.5,8; 86 1,8; 87 0.5,8; 88 0,8; 89 -0.5,8; 90 -1,8; 91 -1.5,8; 92 -2,8; 93 -2.5,8; 94 -3,8; 95 -3.5,8; 96 -4,8; 97 -4.5,8; 98 -5,8; 99 -5.5,8; 100 -6,8
LGA16-4X4 = smd 1 x 0.4: 1 -1.85,0.975; 2 -1.85,0.325; 3 -1.85,-0.325; 4 -1.85,-0.975; 9 1.85,-0.975; 10 1.85,-0.325; 11 1.85,0.325; 12 1.85,0.975 | smd 0.4 x 1: 5 -0.975,-1.85; 6 -0.325,-1.85; 7 0.325,-1.85; 8 0.975,-1.85; 13 0.975,1.85; 14 0.325,1.85; 15 -0.325,1.85; 16 -0.975,1.85
SSOP28DB = smd 0.348 x 1.397: 1 -4.225,-3.656; 2 -3.575,-3.656; 3 -2.925,-3.656; 4 -2.275,-3.656; 5 -1.625,-3.656; 6 -0.975,-3.656; 7 -0.325,-3.656; 8 0.325,-3.656; 9 0.975,-3.656; 10 1.625,-3.656; 11 2.275,-3.656; 12 2.925,-3.656; 13 3.575,-3.656; 14 4.225,-3.656; 15 4.225,3.656; 16 3.575,3.656; 17 2.925,3.656; 18 2.275,3.656; 19 1.625,3.656; 20 0.975,3.656; 21 0.325,3.656; 22 -0.325,3.656; 23 -0.975,3.656; 24 -1.625,3.656; 25 -2.275,3.656; 26 -2.925,3.656; 27 -3.575,3.656; 28 -4.225,3.656
LS20031 = drill 0.9 offset: 1 20.65,-2.3; 2 18.09,-2.31; 3 15.55,-2.31; 4 13.01,-2.31; 5 10.47,-2.31
XBEE-SMD = smd 1.7 x 0.85: 1 -12.5,20; 2 -9.5,18; 3 -12.5,16; 4 -9.5,14; 5 -12.5,12; 6 -9.5,10; 7 -12.5,8; 8 -9.5,6; 9 -12.5,4; 10 -9.5,2; 11 12.5,2; 12 9.5,4; 13 12.5,6; 14 9.5,8; 15 12.5,10; 16 9.5,12; 17 12.5,14; 18 9.5,16; 19 12.5,18; 20 9.5,20
1X03_LOCK = drill 1.016 pad 1.88: 1 0,0.127; 2 2.54,-0.127; 3 5.08,0.127
USB-MINIB-NOSTOP = smd 2.5 x 0.5: D+ 2.5,0; D- 2.5,0.8; GND 2.5,-1.6; ID 2.5,-0.8; VBUS 2.5,1.6 | smd 2.5 x 2: G1 -3,-4.5; G2 -3,4.5; G3 2.5,4.5; G4 2.5,-4.5 | drill 0.9 pad 0.8: H1 0,2.2 | drill 0.9 pad 0.787: H2 0,-2.2

### Placement (x,y rotation side)
1.8VREG  34.44,56.13 180 top
5_PWR  41.74,21.59 270 top
+  3.95,33.95 90 top
-  4.05,16.45 90 top
BMP1  16.53,45.77 0 top
C1  45.94,28.96 270 top
C2  35.42,29.82 0 top
C3  40.24,18.69 0 top
C4  36.75,10.8 270 top
C5  17.92,21.12 180 top
C6  26.1,10.2 0 top
C7  33.2,52.9 180 top
C8  34.26,9.7 0 top
C9  32.14,55.47 90 top
C10  39.24,47.99 90 top
C11  37.61,45.47 180 top
C12  30.71,4.44 90 top
C13  12.24,8.99 0 top
C14  24.4,30.26 270 top
C15  27.43,38.13 90 top
C16  26.13,38.13 90 top
C17  47.5,13 90 top
C18  49.4,11.6 90 top
CSTCE16MOV53-RO16MHZ  35.46,32.3 90 top
D2  11.3,3.98 270 top
D3  49.4,29 90 top
DIO1  8.08,67.21 315 top
F1  14.66,4.24 90 top
GND  53.5,3.7 0 top
HB  41.7,22.8 270 top
ICSP  61.63,28.72 90 top
JP1  52.7,69.2 180 top
LOGO1  5.65,9.21 0 top
M1  66.3,59.3 90 top
M2  32,68 180 top
M3  45,2 180 top
M4  2,25 90 top
PT1  67.33,13.67 270 top
PT2  67.33,11.97 270 top
PT3  67.33,10.37 270 top
Q1  11.47,50.92 180 top
Q2  18.37,53.18 0 top
Q3  42.09,49.54 180 top
Q4  38.91,54.38 180 top
Q5  31.04,36.71 0 top
Q6  35.68,38.59 180 top
R1  7.48,62.52 90 top
R2  3.49,62.49 45 top
R3  47.63,29.04 90 top
R4  11.47,53.5 180 top
R5  18.4,50.55 0 top
R6  10.37,47.97 0 top
R7  15.2,52.02 270 top
R8  37.51,32.29 270 top
R9  44.62,49.29 90 top
R10  38.89,57.04 0 top
R11  42.19,52.29 0 top
R12  42.09,53.92 0 top
R13  41.74,20.08 180 top
R14  31.04,34.13 0 top
R15  48.7,56.31 90 top
R16  33.79,35.8 270 top
R17  41.7,24 0 top
R18  46.2,56.32 90 top
R19  48.7,53.1 90 top
R20  46.25,53.23 270 top
R21  35.48,41.27 180 top
R22  50.4,53.1 270 top
R23  37.56,35.88 90 top
R24  28.75,38.13 270 top
R25  52.9,10.2 270 top
R26  51.4,10.2 270 top
REG1  23.75,4.54 270 top
RSSI  5.76,64.75 315 top
RST  52.47,28.73 90 top
RX  51.4,12.9 0 top
SEL1  32.01,64.63 0 top
SEL2  62.95,59.3 270 top
SEL3  45,5.26 0 top
SEL4  5.3,25 90 top
TX  52.9,12.9 0 top
U1  54,33.19 270 top
U2  47.14,43.41 0 top
U3  35.41,49.09 0 top
U4  29.46,20.14 180 top
U5  25.44,34.3 0 top
U7  50.8,19.3 180 top
U$1  16.46,38.6 270 top
U$2  15.97,40.03 0 top
U$3  65.86,51.31 90 top
U$4  20.4,65.82 0 top
U$5  57.74,66.16 90 top
U$6  13.15,65.87 0 top
USRF  12.77,32.88 90 top
V+  35.8,3.7 0 top
X2  64,20.2 180 top

### Tracks (layer width: path | path; a pad name or v marks a point on that pad's centre or on a via)
1.8V  (via drill 0.3)
  Top 0.178: 39.4,54.5 39.3,54.4 38,54.4 37.9,54.3 | 42.2,53.1 42.1,53.2 42.1,54.6
  Top 0.254: Q3.1 43.03,52.1 R11.2 42.84,52.46 42.2,53.1 | U3.21 U3.22 | U3.22 U3.23 | U3.5 33.07,48.5 v31.9,48.5 | U3.22 37.1,51.43 v37.1,52.4 37.1,53.5 37.9,54.3 | Q4.1 39.86,56.72 R10.2 | Q4.1 39.86,54.96 39.4,54.5 | 42.1,54.6 42.1,54.7 41.32,55.48 Q4.1 | 1.8VREG.5 35.56,55.2 v36.1,55.2 | 35.39,54.44 1.8VREG.5 | C7.1 33.85,53.29 1.8VREG.5
  Route2 0.254: v31.9,48.5 35.8,52.4 v37.1,52.4 37.1,54.2 v36.1,55.2
1_PWR_SEL
  Top 1.422: M1.2 SEL2.2
2_PWR_SEL
  Top 1.422: M2.2 SEL1.2
3_PWR_SEL
  Top 1.422: M4.2 SEL4.2
4_PWR_SEL
  Top 1.422: M3.2 SEL3.2
+3V3  (via drill 0.3, 0.3 pad 0.3)
  Top 0.165: 25.4,38.12 29.7,38.12
  Top 0.17: Q1.1 17.36,52.02
  Top 0.254: BMP1.3 15.16,43.7 BMP1.4 16.53,42.77 16.8,42.5 22.2,42.5 v22.2,42.1 | 14.37,44.5 BMP1.3 | v22.2,35.3 22.38,35.27 U5.1 U5.16 U5.15 25.11,37.81 25.4,38.12 | v20.75,33 21.08,33.33 U5.4 U5.5 24.46,30.97 C14.1 | R21.1 36.63,40.97 Q6.1 36.63,38.93 36.3,38.6 32.5,38.6 32.1,39 30.3,39 29.8,38.5 29.8,38 | R14.1 30.09,34.43 Q5.1 29.8,35.9 29.8,38 | 29.7,38.12 29.8,38 | Q1.1 12.42,53.2 R4.1 | Q2.1 17.42,50.86 R5.1 | 17.36,52.02 Q2.1 | Q2.1 17.48,52.08 17.48,50.82 17.7,50.6 17.4,50.6 16.8,50 14.5,50 12.4,47.9 12.4,45.4 13.2,44.6 14.37,44.6 BMP1.3 | U$2.1 5.67,60.03 v5.7,60 | U2.1 42.7,44.3 43.4,45 66.4,45 67.8,43.6 67.8,40.2 66.43,38.83 U1.4 | U3.6 U3.7 32.34,47.44 v32,47.1
  Top 0.406: U2.1 39.49,40.61 36.9,43.2 v31.7,43.2 31.5,43 25.6,43 v25.4,42.8
  Top 0.61: 29.16,5.66 29.04,5.66 | REG1.4 28.23,5.66 29.04,5.66 | 29.04,5.66 v29.4,5.3
  Top 1.422: REG1.4 27.84,4.34 | 29.16,5.66 29.34,5.84 C12.A
  Route2 0.254: v28.7,6 v29.4,6 | v32,47.1 32,43.5 v31.7,43.2
  Route2 0.406: v22.2,42.1 23.2,42.8 v25.4,42.8
  Route2 0.61: v29.4,5.3 v29.4,6 29.4,6.1 | v5.7,60 5.7,42.6 10.5,37.7 10.5,32.6 13.3,29.8
  Route2 1.016: 29.4,6.1 26.9,6.1 16.6,16.4 13.3,16.4 12.4,17.2 12.4,29.2 13.1,29.8 13.3,29.8 17.4,29.8 v20.75,33 22.2,34.6 v22.2,35.3 v22.2,42.1
+5V  (via drill 0.3, 0.3 pad 0.61)
  Top 0.191: R26.2 51.05,9.55 50.6,10 50.6,11.8
  Top 0.195: C18.A 50.6,11.8
  Top 0.254: 19.5,2 19.65,2 | v32.8,23.2 32.96,23.36 U4.31 32.96,29.36 33.4,29.8 34.75,29.8 C2.1 | 35.44,18.64 U4.10 39.54,18.64 C3.1 39.6,20.9 40.39,21.59 5_PWR.A | 35.44,18.64 U4.100 35.45,11.55 C4.1 | U4.80 25.46,10.69 C6.1 25.45,10.15 23.8,8.5 23.8,4.5 21.6,2.3 18.86,2.3 REG1.3 | 35.44,18.64 35.36,18.64 v33.92,18.64 | U$1.1 11.95,17.95 9.7,20.2 9.7,46.64 R6.2 11.78,47.97 11.78,48.18 14.7,51.1 15.12,51.1 R7.2 | v41.7,56.2 42.74,55.16 R12.2 43.38,53.92 44.6,52.7 44.6,49.96 R9.2 44.66,49.9 v45.6,49.9 | v36.3,57.4 35.22,57.4 1.8VREG.1 35.19,58.51 34.8,58.9 33.7,58.9 33.3,58.5 33.3,57.44 1.8VREG.3 | U4.61 18.59,21.14 C5.1 | U4.61 19.5,21.14 | v53,28.9 50.8,28.9 D3.2 49.29,29.69 R3.2 48.13,29.87 47.2,30.8 44.91,30.8 40.51,35.2 37.6,35.2 37.55,35.15 R16.2 | v57.6,33.3 56.55,32.25 ICSP.2 | R16.2 33.94,35.3 | R23.1 33.87,35.23 R16.2 | U4.61 19.84,21.14 19.8,21.1 19.8,18.2 v19.6,18 | 49.83,13.43 C18.A 48.75,12.35 | U7.4 53.08,21.43 v53.3,21.2 | R26.2 R25.2
  Top 0.406: 49.83,13.43 U7.20 49.83,17.52 50.8,18.5 v53.3,18.5 | 48.75,12.35 C17.1 | 60.2,18.5 X2.VBUS
  Top 0.61: ICSP.2 56.45,29.9 55.1,29.9 54.1,28.9 v53,28.9 | v53.3,18.5 60.2,18.5
  Top 1.422: F1.2 15.21,6.29 | 15.21,6.29 19.5,2 18,2 REG1.3 | 15.21,6.29 15.21,7.36 C13.A 13.46,9.21 15.55,11.3 15.55,15.35 14.2,16.7 14.2,17.91 U$1.1
  Route2 0.254: v33.92,18.64 33.93,23.2 | v41.7,56.2 37.5,56.2 v36.3,57.4 | v45.6,49.9 51.5,44 56.6,44 57.6,43 v57.6,33.3
  Route2 0.61: v53,28.9 47.3,23.2 | 47.3,23.2 33.93,23.2 | v53.3,18.5 v53.3,21.2 51.3,23.2 47.3,23.2
  Route2 1.422: U$1.1 14.21,18 v19.6,18 22.5,18 27.7,23.2 v32.8,23.2 33.93,23.2
AGND  (via drill 0.3, 2.1 pad 4.3)
  Top 0.813: 66.59,13.77 PT1.P$2
  Top 1.27: v64,10 66.59,13.77 | PT1.P$2 PT2.P$2 PT3.P$2
  other vias: 51,7.9 51.7,7.9 52.4,7.9 53.1,7.9 53.8,7.9 54.5,7.9 55.2,7.9 55.9,7.9 51,7.2 51.7,7.2 52.4,7.2 53.1,7.2 53.8,7.2 54.5,7.2 55.2,7.2 55.9,7.2 51,6.5 51.7,6.5 52.4,6.5 53.1,6.5 53.8,6.5 54.5,6.5 55.2,6.5 55.9,6.5 8.2,18.9 8.2,18.2 8.2,17.5 8.2,16.8 8.2,16.1 8.2,15.4 8.2,14.7 8.2,14 7.5,18.9 7.5,18.2 7.5,17.5 7.5,16.8 7.5,16.1 7.5,15.4 7.5,14.7 7.5,14 6.8,18.9 6.8,18.2 6.8,17.5 6.8,16.8 6.8,16.1 6.8,15.4 6.8,14.7 6.8,14 15.6,61.8 14.9,61.8 14.2,61.8 13.5,61.8 12.8,61.8 12.1,61.8 11.4,61.8 10.7,61.8 15.6,62.5 14.9,62.5 14.2,62.5 13.5,62.5 12.8,62.5 12.1,62.5 11.4,62.5 10.7,62.5 15.6,63.2 14.9,63.2 14.2,63.2 13.5,63.2 12.8,63.2 12.1,63.2 11.4,63.2 10.7,63.2 53.6,63.7 53.6,64.4 53.6,65.1 53.6,65.8 53.6,66.5 53.6,67.2 53.6,67.9 53.6,68.6 54.3,63.7 54.3,64.4 54.3,65.1 54.3,65.8 54.3,66.5 54.3,67.2 54.3,67.9 54.3,68.6 55,63.7 55,64.4 55,65.1 55,65.8 55,66.5 55,67.2 55,67.9 55,68.6
  pour Route15 (isolate 0.254, rank 2): -1.02,88.27 55.23,88.44 71.27,87.64 70.3,-0.24 -1.83,-0.43
  pour Top: 50.5,8.5 56.5,8.5 56.5,0.5 50.5,0.5
  pour Top: 0.8,13.4 0.8,19.4 8.8,19.4 8.8,13.4
  pour Top: 8.8,19.4 8.8,13.4 0.8,13.4 0.8,19.4
  pour Top: 16.1,61.2 10.1,61.2 10.1,69.2 16.1,69.2
  pour Top: 53,63.2 53,69.2 61,69.2 61,63.2
  pour Top: 62.8,9.2 67.3,9.2 67.3,14.3 66.3,14.3
AREF
  Top 0.254: U4.98 34.46,10.96 33.61,10.11 C8.1
CELL1  (via drill 0.3)
  Top 0.254: U4.95 32.96,16.44 27.9,21.5 v27.9,25.1 | JP1.P$3 v43.7,55.4
  Route2 0.254: v43.7,55.4 43.7,54.25 37.15,47.62 37.15,36.05 27.9,26.8 v27.9,25.1
CELL2  (via drill 0.3)
  Top 0.254: R20.1 46.25,54.6 | 46.25,54.6 46.25,55.47 R18.1 | U4.96 33.46,16.64 29,21.1 v29,25.4 | v44.8,54.6 46.25,54.6
  Route2 0.254: v44.8,54.6 37.7,47.5 37.7,35.8 29,27.1 v29,25.4
CELL3  (via drill 0.3)
  Top 0.254: R15.1 48.7,53.85 R19.2 47.65,53.85 v47.6,53.9 | U4.97 33.96,16.84 30,20.8 v30,25.4
  Route2 0.254: v47.6,53.9 47.5,53.8 44.83,53.8 38.38,47.42 38.4,47.4 38.4,35.7 30,27.3 v30,25.4
CS  (via drill 0.3)
  Top 0.254: U4.19 35.06,23.14 33.7,24.5 v33.7,25.8 | U2.3 45.24,39.76 45.7,39.3 v46.5,39.3
  Route2 0.191: 48.8,33.9 42.8,27.9 37.3,27.9 35.3,25.9
  Route2 0.254: v33.7,25.8 35.3,25.9 | 48.8,33.9 48.8,37.4 47,39.3 v46.5,39.3
DIN
  Top 0.254: R5.2 19.32,50.86 Q2.2 19.6,52.35 19.6,55.2 19.3,55.5 17.7,55.5 17,54.8 11.9,54.8 7.5,59.2 5.2,59.2 3.47,57.47 U$2.3
DIO5
  Top 0.254: R1.1 7.48,61.32 9.1,59.7 13.9,59.7 17.4,56.2 19.3,56.2 20.3,55.2 20.3,53.9 24.1,50.1 28.4,50.1 U$2.15
DOUT
  Top 0.254: Q1.2 10.52,53.2 R4.2 10.82,54.48 7.3,58 6.5,58 U$2.2
GND  (via drill 0.3, 0.3 pad 0.3, 0.3 pad 0.61)
  Top 0.191: CSTCE16MOV53-RO16MHZ.2 39,32.3
  Top 0.254: 35.8,19.45 36.11,19.14 U4.11 35.96,19.14 35,20.1 | U4.99 35,12.1 35,9.7 C8.2 | U4.32 32.46,26.26 32,25.8 | U5.8 26.41,31.91 v25.7,31.2 | REG1.1 18.83,5.53 v18.7,5.4 | C16.2 25.38,38.78 24,37.4 v24.1,37.3 | U4.32 32.46,26.76 v32,26.3 v31.2,25.5 | U4.32 32.46,26.56 31.8,25.9 | 25.96,13.36 U4.81 25.96,14.96 26,15 | C10.2 39.14,48.54 U3.17 35.86,48.54 35.31,49.09 U3.4 U3.3 | U3.1 U3.28 33.76,51.69 C7.2 | 23.44,20.64 U4.62 22.76,20.64 23.6,19.8 | U1.CD1 54.46,35.3 v55.9,35.3 | U1.CD2 54.46,41 v56,41 | C17.2 48.52,14.68 U7.18 | U7.21 50.5,15.67 50.5,17.1 51,17.1 v51.3,17.4 | U7.25 53.1,15.67 53.1,17.1 | U7.7 51.1,22.93 51.1,21.6
  Top 0.813: PT2.P$1 68.33,11.97 v68.83,11.77
  Top 1.27: PT3.P$1 PT2.P$1 PT1.P$1
  Top 1.422: C13.C 10.66,9.14 v9,10.8
  Route2 1.422: v18.7,5.4 v17.9,5.4 14.4,5.4 v9,10.8
  other vias: 16.2,8.6 15.7,9.3 20.5,8.6 21.3,8.6 21.3,7.8 21.3,7 21.3,6.2 21.3,5.4 21.3,4.6 20.4,4.6 19.5,4.6 19.5,5.4 20.4,5.4 20.4,3.8 21.3,3.8 9,11.6 9.8,11.6 10.6,11.6 10.6,10.8 11.4,10.8 12.2,10.8 9.8,10.8 31.2,26.3 32,25.5 44.3,34.6 44.3,33.8 44.3,33 45.1,33.8 45.1,34.6 45.9,34.6 46.7,35.4 45.1,33 41.2,31 45.9,33 45.9,33.8 46.7,33.8 46.7,34.6 47.5,34.6 47.5,35.4 47.5,36.2 8.3,44.6 8.3,43.7 10.52,26.05 10.52,25.15 7.3,20.6 8.1,20.6 8.9,20.6 8.9,21.4 5.8,62 63.6,46.8 64.7,46.8 43.4,21.2 44.2,21.2 43.4,22.01 67.6,35.2 17.4,59 17.4,58.2 18.2,59 19,59 18.2,58.2 19,58.2 44.2,22 45.5,51.1 46.4,51.1 68.83,13.27 68.83,12.47 68.83,10.97 34.96,21.62 35.72,21.62 34.96,20.86 35.72,20.86 34.96,20.09 35.72,20.09 10.8,44.6 10.8,43.7 22.2,45.9 40.4,31 40.4,31.8 41.2,31.8 30,4.1 30.7,4.1 31.4,4.1 28.1,10.2 28.9,10.2 28.1,9.4 28.9,9.4 48.6,17.6 58.2,10.1 59,10.1 50.6,24.6 39.1,12.7 39.9,12.7 39.1,11.9 39.9,11.9
  pour Top (isolate 0.35, rank 2): -0.4,71.17 72,70.24 73.61,-0.14 65.89,0.36 65.49,0.25 64.9,0.24 61.3,0.3 60.56,0.25 59.96,0.2 -0.05,0.13
  pour Route2: 15.4,3.6 21.5,3.6 21.6,9.5 18.6,12.3 8.4,12.3 8.4,10.6
  pour Route2: 30.4,25.9 31.3,25.6 34.3,25.6 48.6,34 48.6,37.3 46.4,39.2 43,39.4 39,36
  pour Route2 (isolate 0.5): 60.6,0.6 9.5,0.5 0.6,9.3 0.7,60.7 9.3,69.1 60.2,69 69.2,60 69.3,9.5
GPS_RX  (via drill 0.3, 0.3 pad 0.61)
  Top 0.254: U4.2 38.83,14.64 v39.12,14.35 | v28.1,17.5 28.1,18.3 v24.1,22.3
  Route2 0.254: v39.12,14.35 38.61,14.62 34.05,14.7 30.9,14.7 v28.1,17.5 | v24.1,22.3 14.89,22.3 U$1.3
GPS_TX  (via drill 0.3, 0.3 pad 0.61)
  Top 0.254: U4.3 38.71,15.14 v38.99,15.51 | v25.7,18.7 25.7,19.2 v23.6,21.3
  Route2 0.254: 38.66,15.17 v38.99,15.51 32.9,15.51 30,18.4 26,18.4 v25.7,18.7 | v23.6,21.3 14.94,21.3 U$1.2
HB
  Top 0.254: U4.18 40.79,22.64 HB.A
INT_5V  (via drill 0.3)
  Top 1.422: D2.1 10.12,5.38 v9.5,6
  Route2 1.422: SEL3.1 41.2,5.2 39.5,3.5 39.5,2 39,1.5 12,1.5 9.5,4 v9.5,5.1 v9.5,6 v8.6,6 5.5,6 1.5,10 1.5,19 2.5,20 5,20 5.3,20.3 SEL4.1 7.46,22.46 8,23 8,28.5 6.5,30 2.5,30 1.5,31 1.5,60 10,68.5 24,68.5 27.71,64.79 SEL1.1 29.47,62.53 30,62 36,62 38,64 38,67.5 39,68.5 49.5,68.5 51.5,66.5 51.5,62.9 52.56,61.84 SEL2.1
  other vias: 8.6,5.1 7.7,6 7.7,5.1 8.6,4.2 9.5,4.2 6.8,6 9.5,3.3
  pour Route2 (isolate 0.254): 5.5,5.63 10.1,1.13 11.9,0.9 9.1,5.4
  pour Top: 6.8,6.7 6.3,6.2 6.3,5.7 9.2,2.8 9.8,2.8 10,3 10,6.2 9.7,6.7
MISO  (via drill 0.3, 0.3 pad 0.61)
  Top 0.254: U4.22 39.54,24.64 v40,25.2 | U1.7 62.13,35.53 v62.1,35.5 | v51.8,33.9 52.6,34.7 52.6,36.6 53.6,37.6 55.4,37.6 57.5,35.5 v59.4,35.5 | U7.11 48.52,24.48 47.6,25.4 44.7,25.4 v44,26.1
  Route2 0.254: ICSP.9 66.75,27.5 68,27.5 68.3,27.8 68.3,32.1 64.9,35.5 v62.1,35.5 v59.4,35.5 | v40,25.2 43.1,25.2 v44,26.1 v51.8,33.9
MOSI  (via drill 0.3)
  Top 0.254: U4.21 35.96,24.14 v35.55,24.52 | U2.5 47.78,40.22 v50.5,37.5 | U7.3 53.73,24.63 ICSP.1
  Route2 0.191: 50.1,33.37 43.63,26.9 38,26.9 35.62,24.52 v35.55,24.52
  Route2 0.254: 50.1,33.37 50.1,37.2 v50.5,37.5 52.5,37.5 53.5,36.5 53.5,30.5 ICSP.1
N$1
  Top 0.254: R22.2 R19.1
N$2
  Top 0.254: C9.1 31.85,54.83 1.8VREG.4
N$3
  Top 0.254: U2.2 43.97,44.07 44.5,44.52 66.12,44.52 67.25,43.4 67.25,42.3 66.05,41.03 U1.2
N$4
  Top 0.254: U2.4 46.51,43.11 47.6,44.05 62.08,44.05 62.7,43.42 62.7,40.6 63.4,39.9 64.67,39.9 U1.3
N$5
  Top 0.254: U2.6 49.05,42.45 50.17,43.49 61.8,43.49 62.07,43.22 62.07,38.83 63.17,37.73 U1.5
N$6
  Top 0.178: U3.16 39.99,47.99 40,48
  Top 0.254: 40,48 40.2,47.8 40.2,46.7 38.97,45.47 C11.1
N$7
  Top 0.203: 41.09,20.49 41.5,20.9 41.9,20.9
  Top 0.254: R13.2 41.09,20.49 | 41.9,20.9 5_PWR.C
N$8
  Top 0.254: DIO1.A 7.55,66.65 8.1,66.1 8.1,63.78 R1.2
N$9
  Top 0.254: R2.2 3.95,62.95 RSSI.A
N$10
  Top 0.254: HB.C R17.2
N$11
  Top 0.254: R25.1 TX.A
N$13
  Top 0.254: U3.12 35.96,45.94 36.4,45.5 36.93,45.5 C11.2
N$14
  Top 0.254: U3.15 39.15,47.44 C10.1
N$15
  Top 1.422: D2.2 14.27,2.58 F1.1
N$16
  Top 0.254: R11.1 41.13,51.89 Q3.2 39.54,50.64 39.09,50.19 U3.20 36.11,50.19 35.96,50.34 U3.24
N$17
  Top 0.254: U3.19 35.86,49.64 35.4,50.1 35.4,51.38 U3.25 35.41,52.93 Q4.2 37.96,56.76 R10.1
N$18
  Top 0.254: JP1.P$2 46.2,56.82 R18.2
N$19
  Top 0.254: U5.14 25.76,37.11 C16.1 C15.1
N$20
  Top 0.254: C15.2 28.73,38.78 R24.1
N$21
  Top 0.254: R15.2 JP1.P$1
N$22
  Top 0.254: RX.A R26.1
PWM1  (via drill 0.3 pad 0.25, 0.3 pad 0.61)
  Top 0.254: M1.3 64.84,63.3 61.9,63.3 60.1,61.5 60.1,47.9 62.5,45.5 67.6,45.5 69.2,43.9 69.2,32.5 69.4,32.1 69.5,15.4 v69.3,15.1 | U4.5 43.46,16.14 v44,15.6
  Route2 0.254: v69.3,15.1 68.7,15 63.7,15 63.4,15.3 44.3,15.3 v44,15.6
PWM2  (via drill 0.3, 0.3 pad 0.25, 0.3 pad 0.61)
  Top 0.254: v68.8,16.2 68.8,30.4 66.8,31.9 66.2,31.9 65.6,32.5 62.2,32.5 61,33.7 61,38.3 v56.6,42.7 | M2.3 27.6,68 27.1,67.5 27.1,63.3 30.4,60 30.4,45.7 32.2,43.9 40.5,43.9 v40.9,43.4 | U4.6 44.44,16.64 v44.5,16.7
  Route2 0.254: v40.9,43.4 55.9,43.4 v56.6,42.7 | v68.8,16.2 45.2,16 v44.5,16.7
PWM3  (via drill 0.3, 0.3 pad 0.61)
  Top 0.254: U4.7 38.83,17.14 v38.81,17.28 | M4.3 2,28.6 3.4,30 v8.8,30 | v11.2,30.4 15.2,30.4 v17.2,28.4 | v27.2,20.3 25.1,22.4 v25.1,23.4
  Route2 0.254: v38.81,17.28 38.7,17.2 33.1,17.2 30,20.3 v27.2,20.3 | v8.8,30 10.8,30 v11.2,30.4 | v17.2,28.4 18,28.4 23,23.4 v25.1,23.4
PWM4  (via drill 0.3)
  Top 0.254: U4.15 38.64,21.14 v39.3,21.8 | v40.7,7.2 40.7,3.1 41.7,2.1 42.36,2.1 M3.3
  Route2 0.254: v39.3,21.8 39.3,20.95 41.61,18.8 41.61,8.11 v40.7,7.2
RESET  (via drill 0.3 pad 0.61)
  Top 0.191: 46.49,29.61 46.8,29.3 46.8,28.6 47,28.4 | ICSP.5 61.6,27.48 61.6,28.7 55.5,28.7 53.17,26.37 RST.P$1
  Top 0.254: U4.30 33.46,26.84 33.8,26.5 35.8,26.5 36.2,26.9 42.8,26.9 45.5,29.6 46.43,29.6 C1.1 46.49,29.61 | 47,28.4 48.12,28.4 R3.1 49.01,28.39 D3.1 50.45,27.6 RST.P$1 | U7.2 54.38,23.98 v55.1,24.7
  Route2 0.254: v55.1,24.7 60.1,24.7 61.6,26.2 61.6,27.43 ICSP.5
RSSI
  Top 0.254: R2.1 3.04,61.94 1.6,60.5 1.6,50.7 2.3,50 6.43,50 U$2.6
RXLED
  Top 0.254: U7.22 51.12,13.72 RX.C
SCK  (via drill 0.3, 0.3 pad 0.61)
  Top 0.191: 34.5,24.52 v34.5,25.2
  Top 0.254: U4.20 35.46,23.64 34.5,24.52 | U2.7 50.32,39.02 | 50.32,39.02 v50.3,39 | 50.32,39.02 56.48,39.02 v58.9,36.6 | U7.1 55.46,22.96 v56.4,23.9
  Route2 0.191: 49.4,33.55 43.25,27.4 37.6,27.4 35.4,25.2 v34.5,25.2
  Route2 0.254: 49.4,33.55 49.4,38.1 v50.3,39 | ICSP.7 64.2,27.42 64.2,26.3 64.4,26.1 64.6,26.1 | 64.6,26.1 68.5,26.1 69.2,26.8 69.2,32.5 65.1,36.6 v58.9,36.6 | v56.4,23.9 62.4,23.9 64.6,26.1
SCL3V3
  Top 0.254: R21.2 34.73,40.97 Q6.2 34.12,40.3 27.9,40.3 27.29,39.69 25.49,39.69 | 25.49,39.69 21.45,35.8 21.45,35.1 21.92,34.62 U5.2 | BMP1.6 20.43,45.77 25.5,40.7 25.5,39.7 25.49,39.69
SCL5V  (via drill 0.3, 0.3 pad 0.3, 0.3 pad 0.61)
  Top 0.254: v35.5,36.3 35.68,36.48 Q6.3 36.6,37.49 R23.2 | R9.1 44.42,48.44 Q3.3 41.1,47.46 41.1,46.5 39.1,44.5 35.4,44.5 v35.1,44.8 | U4.43 26.96,29.36 27.2,29.6 27.8,29.6 v28.3,30.1
  Route2 0.254: 35.6,36.1 v35.5,36.3 | v35.1,44.8 35.5,44.4 v35.5,36.3 | v28.3,30.1 30.5,30.1 35.5,35.1 v35.5,36.3
SDA3V3  (via drill 0.3)
  Top 0.165: 25.9,30.25 22.4,30.25
  Top 0.254: Q5.2 31.99,34.43 R14.2 31.69,33.49 31.5,33.3 29,33.3 25.9,30.25 | 22.4,30.25 20,32.6 20,33.2 20.77,33.98 | U5.3 20.77,33.98 | 20.77,33.98 20.62,33.98 v20,34.6 | BMP1.7 20.34,47.04 v20.4,47.1
  Route2 0.254: v20.4,47.1 20.4,35 v20,34.6
SDA5V  (via drill 0.3, 0.3 pad 0.3, 0.3 pad 0.61)
  Top 0.254: R16.1 33.12,37.12 | 33.12,37.12 32.42,37.81 Q5.3 | 33.12,37.12 v33.9,37.9 | R12.1 40.62,53.28 Q4.3 39.1,53.09 v39.1,52.1 | U4.44 26.46,29.66 v27.3,30.5
  Route2 0.254: v39.1,52.1 33.9,46.9 v33.9,37.9 27.3,31.3 v27.3,30.5
TXLED
  Top 0.254: U7.23 51.77,14.62 52.5,13.9 TX.C
USB_D+
  Top 0.254: X2.D+ 48.9,20.2 46.58,17.88 U7.15
USB_D-
  Top 0.254: U7.16 47.23,17.43 49.2,19.4 X2.D-
USRF_AN
  Top 0.191: 23.08,25.11 23.08,26.5
  Top 0.254: U4.94 32.46,16.14 27.3,21.3 27.3,23.5 26.6,24.2 24,24.2 23.08,25.11 | 23.08,26.5 14.18,35.42 USRF.2
USRF_ON
  Top 0.254: USRF.1 15.92,32.88 21.4,27.4 21.4,26.2 U4.51
VBATT  (via drill 0.3, 2.1 pad 4.3)
  other vias: 60,6 33.3,7.9 34,7.9 34.7,7.9 35.4,7.9 36.1,7.9 36.8,7.9 37.5,7.9 38.2,7.9 33.3,7.2 34,7.2 34.7,7.2 35.4,7.2 36.1,7.2 36.8,7.2 37.5,7.2 38.2,7.2 33.3,6.5 34,6.5 34.7,6.5 35.4,6.5 36.1,6.5 36.8,6.5 37.5,6.5 38.2,6.5 8.1,36.4 8.1,35.7 8.1,35 8.1,34.3 8.1,33.6 8.1,32.9 8.1,32.2 8.1,31.5 7.4,36.4 7.4,35.7 7.4,35 7.4,34.3 7.4,33.6 7.4,32.9 7.4,32.2 7.4,31.5 6.7,36.4 6.7,35.7 6.7,35 6.7,34.3 6.7,33.6 6.7,32.9 6.7,32.2 6.7,31.5 22.85,61.75 22.15,61.75 21.45,61.75 20.75,61.75 20.05,61.75 19.35,61.75 18.65,61.75 17.95,61.75 22.85,62.45 22.15,62.45 21.45,62.45 20.75,62.45 20.05,62.45 19.35,62.45 18.65,62.45 17.95,62.45 22.85,63.15 22.15,63.15 21.45,63.15 20.75,63.15 20.05,63.15 19.35,63.15 18.65,63.15 17.95,63.15 61.75,48.85 61.75,49.55 61.75,50.25 61.75,50.95 61.75,51.65 61.75,52.35 61.75,53.05 61.75,53.75 62.45,48.85 62.45,49.55 62.45,50.25 62.45,50.95 62.45,51.65 62.45,52.35 62.45,53.05 62.45,53.75 63.15,48.85 63.15,49.55 63.15,50.25 63.15,50.95 63.15,51.65 63.15,52.35 63.15,53.05 63.15,53.75
  pour Bottom (isolate 0.381, rank 3): -0.76,69.29 0.1,0 70.61,-0.1 70.31,70.72 0,70.66
  pour Top: 32.76,8.51 38.76,8.51 38.76,0.51 32.76,0.51
  pour Top (isolate 0.381): 0.7,30.9 0.7,36.9 8.7,36.9 8.7,30.9
  pour Top: 23.39,61.14 17.39,61.14 17.39,69.14 23.39,69.14
  pour Top: 61.14,48.31 61.14,54.31 69.14,54.31 69.14,48.31
XB_RX  (via drill 0.3)
  Top 0.254: Q1.3 9.72,48.07 R6.1 8.53,47.97 v8.5,48 | U4.45 25.96,26.36 25.2,25.67 v23.7,25.67
  Route2 0.254: v8.5,48 9.4,48.9 21.6,48.9 21.6,48.8 27,43.4 27,34.9 23.7,31.6 v23.7,25.67
XB_TX  (via drill 0.3)
  Top 0.165: 18.4,49.7 18.4,54.25
  Top 0.254: R7.1 15.58,52.68 17.1,54.2 18.3,54.2 Q2.3 18.4,54.25 | U4.46 25.46,26.76 25.2,26.5 v24.4,26.5 | v21.5,49.7 18.4,49.7
  Route2 0.254: v21.5,49.7 27.6,43.6 27.6,34.7 24.4,31.5 v24.4,26.5
XTAL1
  Top 0.254: U4.34 31.46,31.86 32.9,33.3 CSTCE16MOV53-RO16MHZ.3 37.15,33.3 R8.1
XTAL2
  Top 0.254: U4.33 31.96,30.46 32.8,31.3 CSTCE16MOV53-RO16MHZ.1 37.17,31.3 R8.2

### Text on the board
tPlace: GND | on | off | OSQ Control Board | Version 4 | on | May 2014 | off | GND | Y | Z | X | BMP085 | off | on | GND | on | off | - | + | GND